# Altium project JCXT.PrjPcb
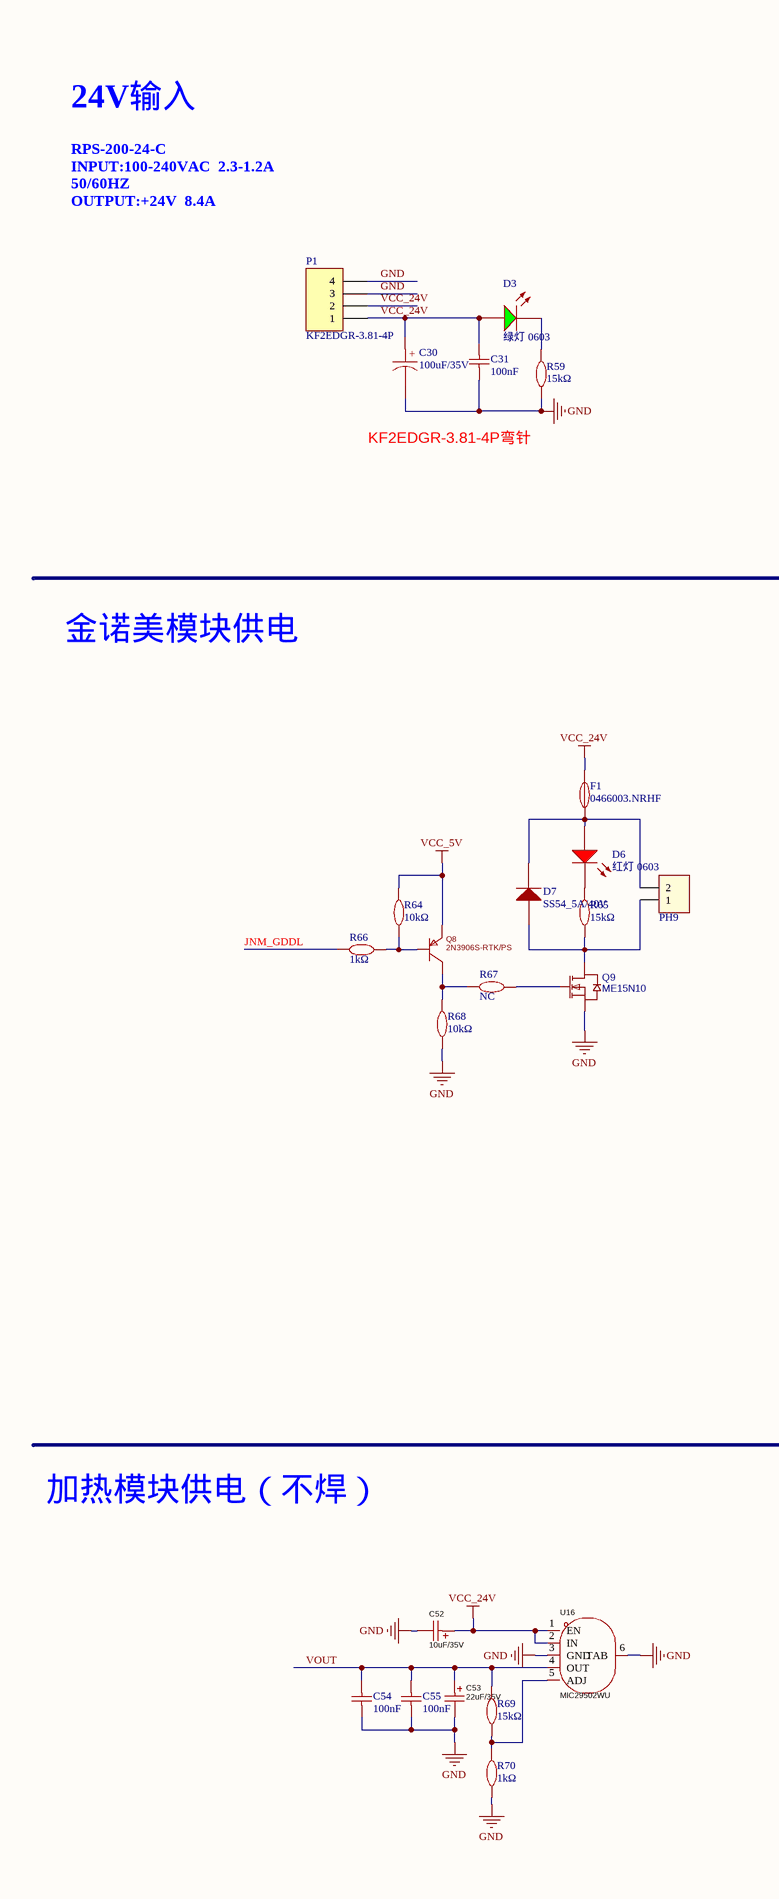
[diagram p0: Power.SchDoc, left]
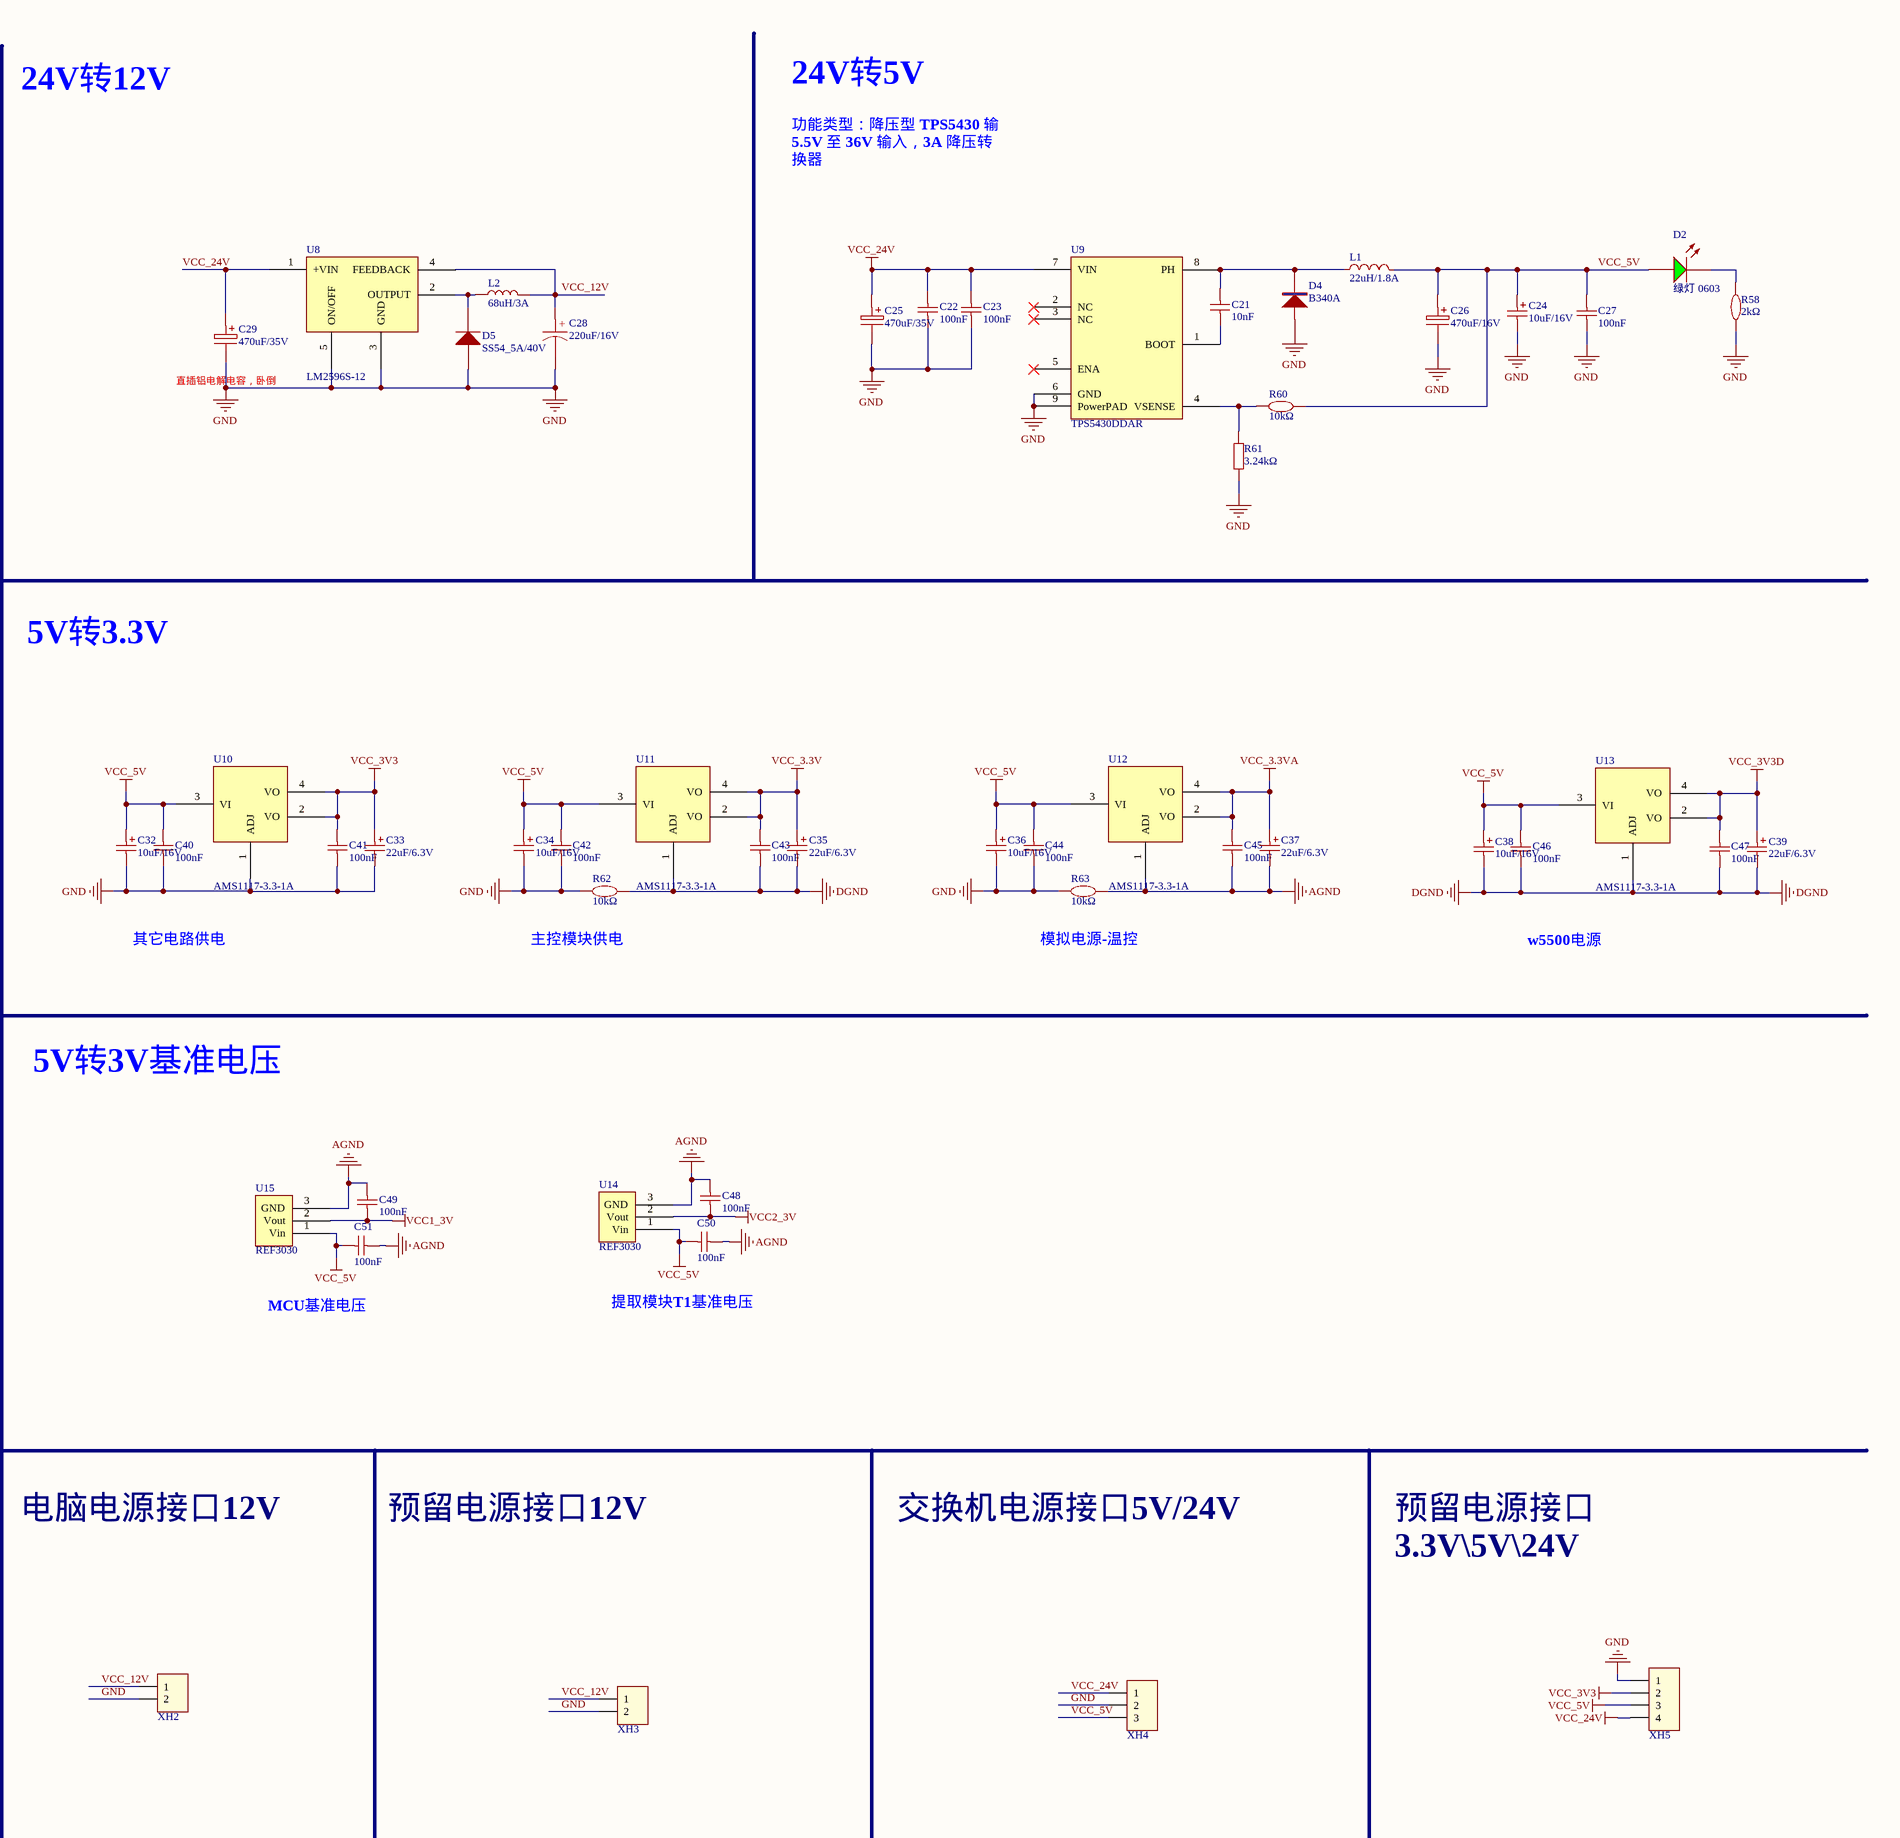
[diagram p1: Power.SchDoc, right]
10 sheets, 309 parts. Net scope: global (net labels, ports and power ports of the same name join across sheets).
Board file: PCB1.PcbDoc
Sheets:
  Power.SchDoc
  EEPROM.SchDoc
  LED.SchDoc
  Motor.SchDoc
  STM32F429.SchDoc
  Temp.SchDoc
  W5500.SchDoc
  CAN.SchDoc
  RS232.SchDoc
  USB.SchDoc

## Sheet Power.SchDoc
size A2

### Parts
C21  10nF  [C0603]
C22  100nF  [C0603]
C23  100nF  [C0603]
C24  10uF/16V  [CASE-A_3216]
C25  470uF/35V  [ELE-S-10.5/D10]
C26  470uF/16V  [ELE-S-10.5/D8.0]
C27  100nF  [C0603]
C28  220uF/16V  [SMD-ECAP-6.3×7.7]
C29  470uF/35V  [ELE-S-10.5/D10]
C30  100uF/35V  [SMD-ECAP-6.3×7.7]
C31  100nF  [C0603]
C32  10uF/16V  [CASE-A_3216]
C33  22uF/6.3V  [CASE-A_3216]
C34  10uF/16V  [CASE-A_3216]
C35  22uF/6.3V  [CASE-A_3216]
C36  10uF/16V  [CASE-A_3216]
C37  22uF/6.3V  [CASE-A_3216]
C38  10uF/16V  [CASE-A_3216]
C39  22uF/6.3V  [CASE-A_3216]
C40  100nF  [C0603]
C41  100nF  [C0603]
C42  100nF  [C0603]
C43  100nF  [C0603]
C44  100nF  [C0603]
C45  100nF  [C0603]
C46  100nF  [C0603]
C47  100nF  [C0603]
C48  100nF  [C0603]
C49  100nF  [C0603]
C50  100nF  [C0603]
C51  100nF  [C0603]
C52  10uF/35V  [CASE-D_7343]
C53  22uF/35V  [CAP-SMD_L7.3-W4.3-RD]
C54  100nF  [C0805]
C55  100nF  [C0805]
D2  绿灯 0603  [LED_0603]
D3  绿灯 0603  [LED_0603]
D4  B340A  [D-SMA]
D5  SS54_5A/40V  [SMA(DO-214AC)_S5]
D6  红灯 0603  [LED_0603]
D7  SS54_5A/40V  [SMA(DO-214AC)_S5]
F1  0466003.NRHF  [F1206]
L1  22uH/1.8A  [L-6X6X4.5]
L2  68uH/3A  [SMD INDUCTOR 68uH 3A]
P1  KF2EDGR-3.81-4P  [KF2EDGK 3.81mm-4P]
PH9  PH2.0-2P  [PH2.0-2P 弯针]  (value not drawn)
Q8  2N3906S-RTK/PS  [SOT-23-3_L2.9-W1.3-P1.90-LS2.4-TR]
Q9  ME15N10  [TO-252-2_L6.6-W6.1-P4.57-LS9.9-TL-CW]
R58  2kΩ  [R0603]
R59  15kΩ  [R0603]
R60  10kΩ  [R0603]
R61  3.24kΩ  [R0603]
R62  10kΩ  [R1206]
R63  10kΩ  [R1206]
R64  10kΩ  [R0603]
R65  15kΩ  [R0603]
R66  1kΩ  [R0603]
R67  NC  [R0603]
R68  10kΩ  [R0603]
R69  15kΩ  [R1206]
R70  1kΩ  [R1206]
U8  LM2596S-12  [TO-263-5]
U9  TPS5430DDAR  [IC-SO8-PAD]
U10  AMS1117-3.3-1A  [LM1117I(SOT223)]
U11  AMS1117-3.3-1A  [LM1117I(SOT223)]
U12  AMS1117-3.3-1A  [LM1117I(SOT223)]
U13  AMS1117-3.3-1A  [LM1117I(SOT223)]
U14  REF3030  [SOT-23(SOT-23-3)]
U15  REF3030  [SOT-23(SOT-23-3)]
U16  MIC29502WU  [TO-263-5_L10.2-W9.9-P1.70-LS14.4-TL]
XH2  PH2.0-2P  [PH2.0-2P 弯针]  (value not drawn)
XH3  PH2.0-2P  [PH2.0-2P 弯针]  (value not drawn)
XH4  PH2.0-3P  [PH2.0-3P 弯针]  (value not drawn)
XH5  PH2.0-4P  [PH2.0-4P 弯针]  (value not drawn)

### Nets
AGND: C37.2 C45.1 C48.2 C49.2 C50.2 C51.2 R63.2 U12.1(ADJ) U14.3(GND) U15.3(GND)
DGND: C35.2 C38.2 C39.2 C43.1 C46.1 C47.1 R62.2 U11.1(ADJ) U13.1(ADJ)
GND: C22.1 C23.1 C24.2 C25.2 C26.2 C27.1 C28.2 C29.2 C30.2 C31.1 C32.2 C33.2 C34.2 C36.2 C40.1 C41.1 C42.1 C44.1 C52.2 C53.2 C54.1 C55.1 D4.1 D5.1(A) P1.3 P1.4 Q9.3(S) R58.2 R59.1 R61.1 R62.1 R63.1 R68.2 R70.2 U8.3(GND) U8.5(ON/OFF) U9.6(GND) U9.9(PowerPAD) U10.1(ADJ) U16.3(GND) U16.6(TAB) XH2.2 XH3.2 XH4.2 XH5.1
VCC1_3V: C49.1 U15.2(Vout)
VCC2_3V: C48.1 U14.2(Vout)
VCC_3.3V: C35.1 C43.2 U11.2(VO) U11.4(VO)
VCC_3.3VA: C37.1 C45.2 U12.2(VO) U12.4(VO)
VCC_3V3: C33.1 C41.2 U10.2(VO) U10.4(VO) XH5.2
VCC_3V3D: C39.1 C47.2 U13.2(VO) U13.4(VO)
VCC_5V: C24.1 C26.1 C27.2 C32.1 C34.1 C36.1 C38.1 C40.2 C42.2 C44.2 C46.2 C50.1 C51.1 D2.A L1.1 Q8.1(E) R60.1 R64.1 U10.3(VI) U11.3(VI) U12.3(VI) U13.3(VI) U14.1(Vin) U15.1(Vin) XH4.3 XH5.3
VCC_12V: C28.1 L2.2 U8.4(FEEDBACK) XH2.1 XH3.1
VCC_24V: C22.2 C23.2 C25.1 C29.1 C30.1 C31.2 C52.1 D3.A F1.2 P1.1 P1.2 U8.1(+VIN) U9.7(VIN) U16.1(EN) U16.2(IN) XH4.1 XH5.4
VOUT: C53.1 C54.2 C55.2 R69.1 U16.4(OUT)
JNM_GDDL: R66.1
NetC21_1: C21.1 U9.1(BOOT)
NetC21_2: C21.2 D4.2 L1.2 U9.8(PH)
NetD2_K: D2.K R58.1
NetD3_K: D3.K R59.2
NetD5_2: D5.2(K) L2.1 U8.2(OUTPUT)
NetD6_A: D6.A D7.2(K) F1.1 PH9.2
NetD6_K: D6.K R65.2
NetD7_1: D7.1(A) PH9.1 Q9.2(D) R65.1
NetQ8_2: Q8.2(B) R64.2 R66.2
NetQ8_3: Q8.3(C) R67.1 R68.1
NetQ9_1: Q9.1(G) R67.2
NetR60_2: R60.2 R61.2 U9.4(VSENSE)
NetR69_2: R69.2 R70.1 U16.5(ADJ)

Not connected (* = marked no-connect by the designer): U9 2(NC)* 3(NC)* 5(ENA)*

### Notes on the sheet
- 24V转5V
- 24V输入
- 24V转12V
- RPS-200-24-C
  INPUT:100-240VAC  2.3-1.2A
  50/60HZ
  OUTPUT:+24V  8.4A
- 功能类型：降压型 TPS5430 输5.5V 至 36V 输入，3A 降压转换器
- (near C29) 直插铝电解电容，卧倒
- KF2EDGR-3.81-4P弯针
- 5V转3.3V
- 金诺美模块供电
- 其它电路供电
- (near R62) 主控模块供电
- (near R63) 模拟电源-温控
- w5500电源
- 5V转3V基准电压
- MCU基准电压
- 提取模块T1基准电压
- 加热模块供电（不焊）
- 电脑电源接口12V
- 预留电源接口12V
- 交换机电源接口5V/24V
- 预留电源接口
  3.3V\5V\24V
- (in symbol 100uF/35V,SMD,6.3x7.7mm) +
- (in symbol 220uF/16V,SMD,D6.3x7.7mm) +

### Library data of the parts
C21 = 10nF/50V,C0603: 贴片电容,X7R; ComponentLink1Description: 供应商链接; ComponentLink1URL: http://www.szlcsc.com/product/details_16531.html
C22 C23 C27 C31 C40-C51 = 100nF/50V,C0603: 贴片电容,X7R; ComponentLink1Description: 供应商链接; ComponentLink1URL: http://www.szlcsc.com/product/details_16531.html
C24 C32 C34 C36 C38 = 10uF/16V,CASE-A_3216 : 钽电容;±10%;16V; ComponentLink1Description: 供应商链接; ComponentLink1URL: http://www.szlcsc.com/product/details_7643.html
C25 C29 = 470uF/35V,D10*10.5mm: 贴片型铝电解电容
C26 = 470uF/16V,D8*10.5mm: 贴片型铝电解电容
C28 = 220uF/16V,SMD,D6.3x7.7mm: 贴片型铝电解电容
C30 = 100uF/35V,SMD,6.3x7.7mm: 贴片型铝电解电容
C33 C35 C37 C39 = 22uF/6.3V,CASE-A_3216: 钽电容;±10%;6.3V; ComponentLink1Description: 供应商链接; ComponentLink1URL: http://www.szlcsc.com/product/details_7643.html
C52 = 10uF/35V,CASE-D-7343: TAJD106K035RNJ;钽电容;容值 10uF;精度 ±10%; 额定电压 35V;等效串联电阻(ESR) 1Ω@100kHz
C53 = 22uF/35V,CASE-D-7343: TAJD226K035RNJ;钽电容;容值 22uF; 精度 ±10%额定电压 35V;等效串联电阻(ESR) 900mΩ@100kHz
C54 C55 = 100nF/50V,C0805: 贴片电容,X7R; ComponentLink1Description: 供应商链接; ComponentLink1URL: http://www.szlcsc.com/product/details_16531.html
D2 D3 = 绿灯 0603: 发光二极管; ComponentLink1Description: 供应商链接; ComponentLink1URL: http://www.szlcsc.com/product/details_73152.html
D4 = B340A: 肖特基二极管；正向压降(Vf) 550mV@3A； 直流反向耐压(Vr) 40V； 整流电流 3A； 反向电流(Ir) 500uA@40V
D5 D7 = SS54_5A/40V: 肖特基二极管; ComponentLink1Description: Manufacturer Link; ComponentLink1URL: http://www.fairchildsemi.com/; ComponentLink2Description: Datasheet; ComponentLink2URL: http://www.fairchildsemi.com/ds/1N%2F1N4001.pdf
D6 = 红灯 0603: 发光二极管; ComponentLink1Description: 供应商链接; ComponentLink1URL: http://www.szlcsc.com/product/details_2659.html
F1 = 0466003.NRHF: 一次性贴片式保险丝；额定电流 3A；额定电压 (AC) 32V
L1 = 22uH/1.8A,L-6X6X4.5: SWPA6045S220MT;功率电感;SMD,6x6mm;电感值 22uH;精度 ±20%;额定电流 1.8A;饱和电流(Isat) 2.2A;直流电阻(DCR) 89mΩ
L2 = 68uH/3A,SMD,11.5x10mm: YSPI1050-680M;功率电感;电感值 68uH;精度 ±20%;额定电流 3A;直流电阻(DCR) 240mΩ
P1 = KF2EDGR-3.81-4P: C441184
Q8 = 2N3906S-RTK/PS: Manufacturer: KEC; Symbol: 2N3906S-RTK/PS_C5300004; Add into BOM: yes; Current - Collector(Ic): 200mA; Collector - Emitter Voltage VCEO: 40V; Pd - Power Dissipation: 350mW; DC Current Gain: 300@10mA,1V; Transition frequency(fT): 250MHz; Current - Collector Cutoff: 50nA; Vce Saturation(VCE(sat)): 400mV@50mA,5mA; Emitter-Base Voltage(Vebo): 5V; Device: 2N3906S-RTK/PS; LCSC Part Name: 2N3906S-RTK/PS; Supplier Part: C5300004; Manufacturer Part: 2N3906S-RTK/PS; Supplier Footprint: SOT-23; JLCPCB Part Class: Extended Part; Datasheet: https://item.szlcsc.com/datasheet/2N3906S-RTK%252FPS/6051230.html; Supplier: LCSC; Convert to PCB: yes
Q9 = ME15N10: 场效应管(MOSFET);N沟道
R58 = 2kΩ,R0603: 贴片电阻
R59 R65 = 15kΩ,R0603: 贴片电阻
R60 R64 R68 = 10kΩ,R0603: 电阻类型:厚膜电阻;阻值:10kΩ;精度:±1%;功率:100mW;最大工作电压:75V;温度系数:±100ppm/℃;
R61 = 3.24kΩ,R0603: 贴片电阻3.24KΩ;1%; ComponentLink1Description: 供应商链接; ComponentLink1URL: http://www.szlcsc.com/product/details_21904.html
R62 R63 = 0603WAF1002T5E: 贴片电阻
R66 = 1kΩ,R0603: 电阻类型:厚膜电阻;阻值:1kΩ;精度:±1%;功率:125mW;最大工作电压:150V;温度系数:±100ppm/℃;
R67 = NC,R0603
R69 = 15kΩ,R1206: 贴片电阻
R70 = 1kΩ,R1206: 贴片电阻
U9 = TPS5430DDAR: DC-DC电源芯片；降压型；可调； 工作电压 5.5V~36V；输出电压 1.221V~32.04V；输出电流 3A / 开关频率 500kHz
U10-U13 = AMS1117-3.3-1A: 800mA Low Dropout Regulator
U14 U15 = REF3030: REF3030AIDBZR/REF3030AIDBZT
U16 = MIC29502WU: 线性稳压器(LDO)

## Sheet EEPROM.SchDoc
size A4
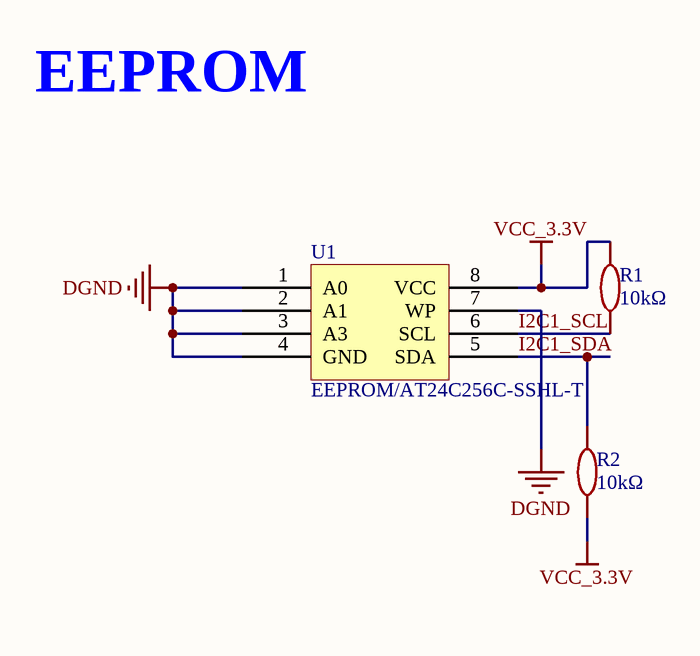
[diagram p2: EEPROM.SchDoc]

### Parts
R1  10kΩ  [R0402]
R2  10kΩ  [R0402]
U1  EEPROM/AT24C256C-SSHL-T  [SOIC-8_150mil]

### Nets
DGND: U1.1(A0) U1.2(A1) U1.3(A3) U1.4(GND) U1.7(WP)
VCC_3.3V: R1.2 R2.1 U1.8(VCC)
I2C1_SCL: R1.1 U1.6(SCL)
I2C1_SDA: R2.2 U1.5(SDA)

### Notes on the sheet
- EEPROM

### Library data of the parts
R1 R2 = 10kΩ,R0402: 电阻类型:厚膜电阻;阻值:10kΩ;精度:±1%;功率:100mW;最大工作电压:75V;温度系数:±100ppm/℃;
U1 = EEPROM/AT24C256C-SSHL-T_[C6482]: EEPROM; ComponentLink1Description: 供应商链接; ComponentLink1URL: http://www.szlcsc.com/product/details_6947.html

## Sheet LED.SchDoc
size A4
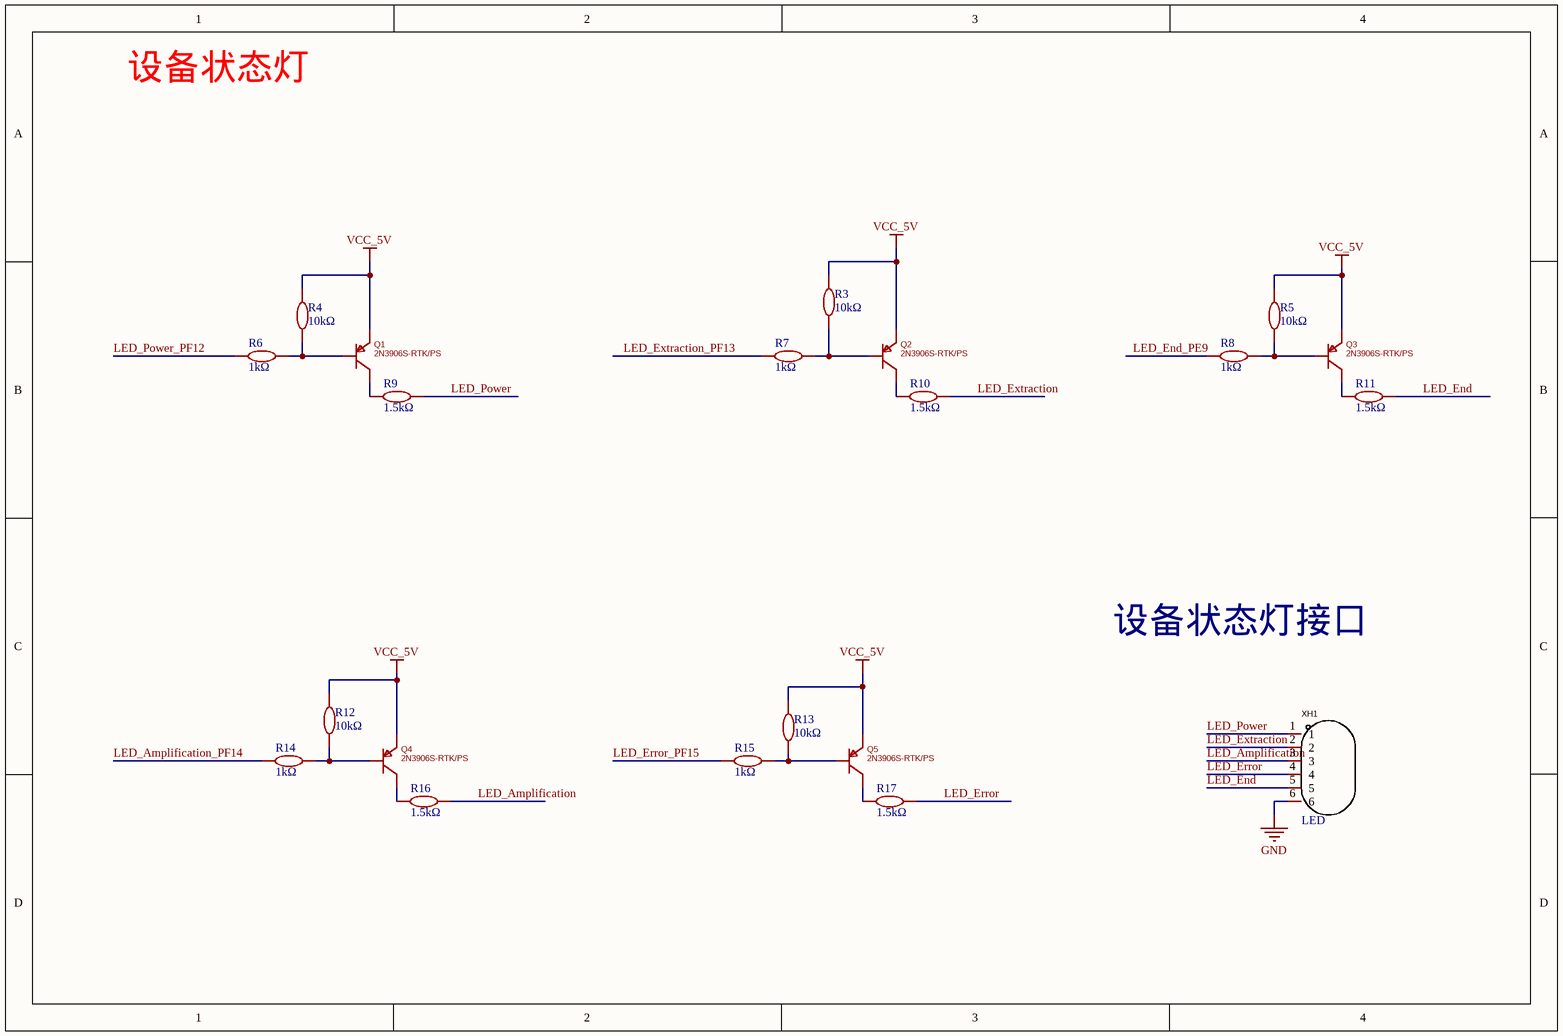
[diagram p3: LED.SchDoc]

### Parts
Q1  2N3906S-RTK/PS  [SOT-23-3_L2.9-W1.3-P1.90-LS2.4-TR]
Q2  2N3906S-RTK/PS  [SOT-23-3_L2.9-W1.3-P1.90-LS2.4-TR]
Q3  2N3906S-RTK/PS  [SOT-23-3_L2.9-W1.3-P1.90-LS2.4-TR]
Q4  2N3906S-RTK/PS  [SOT-23-3_L2.9-W1.3-P1.90-LS2.4-TR]
Q5  2N3906S-RTK/PS  [SOT-23-3_L2.9-W1.3-P1.90-LS2.4-TR]
R3  10kΩ  [R0603]
R4  10kΩ  [R0603]
R5  10kΩ  [R0603]
R6  1kΩ  [R0603]
R7  1kΩ  [R0603]
R8  1kΩ  [R0603]
R9  1.5kΩ  [R0603]
R10  1.5kΩ  [R0603]
R11  1.5kΩ  [R0603]
R12  10kΩ  [R0603]
R13  10kΩ  [R0603]
R14  1kΩ  [R0603]
R15  1kΩ  [R0603]
R16  1.5kΩ  [R0603]
R17  1.5kΩ  [R0603]
XH1  LED  [CONN-TH_6P-P2.00_S6B-PH-K-S-LF-SN]

### Nets
GND: XH1.6
VCC_5V: Q1.1(E) Q2.1(E) Q3.1(E) Q4.1(E) Q5.1(E) R3.2 R4.2 R5.2 R12.2 R13.2
LED_Amplification: R16.1 XH1.3
LED_Amplification_PF14: R14.2
LED_End: R11.1 XH1.5
LED_End_PE9: R8.2
LED_Error: R17.1 XH1.4
LED_Error_PF15: R15.2
LED_Extraction: R10.1 XH1.2
LED_Extraction_PF13: R7.2
LED_Power: R9.2 XH1.1
LED_Power_PF12: R6.2
NetQ1_2: Q1.2(B) R4.1 R6.1
NetQ1_3: Q1.3(C) R9.1
NetQ2_2: Q2.2(B) R3.1 R7.1
NetQ2_3: Q2.3(C) R10.2
NetQ3_2: Q3.2(B) R5.1 R8.1
NetQ3_3: Q3.3(C) R11.2
NetQ4_2: Q4.2(B) R12.1 R14.1
NetQ4_3: Q4.3(C) R16.2
NetQ5_2: Q5.2(B) R13.1 R15.1
NetQ5_3: Q5.3(C) R17.2

### Notes on the sheet
- 设备状态灯
- 设备状态灯接口

### Library data of the parts
Q1-Q5 = 2N3906S-RTK/PS: as Q8 on sheet Power; Device: 2N3906S-RTK/PS; LCSC Part Name: 2N3906S-RTK/PS; Supplier Part: C5300004; Manufacturer Part: 2N3906S-RTK/PS; Supplier Footprint: SOT-23; JLCPCB Part Class: Extended Part; Datasheet: https://item.szlcsc.com/datasheet/2N3906S-RTK%252FPS/6051230.html; Supplier: LCSC; Convert to PCB: yes
R3-R5 R12 R13 = 10kΩ,R0603: as R60 on sheet Power
R6-R8 R14 R15 = 1kΩ,R0603: as R66 on sheet Power
R9-R11 R16 R17 = 1.5kΩ,R0603: 电阻类型:厚膜电阻;阻值:1.5kΩ;精度:±1%;功率:100mW;最大工作电压:75V;温度系数:±100ppm/℃;
XH1 = S6B-PH-K-S(LF)(SN)

## Sheet Motor.SchDoc
size A2
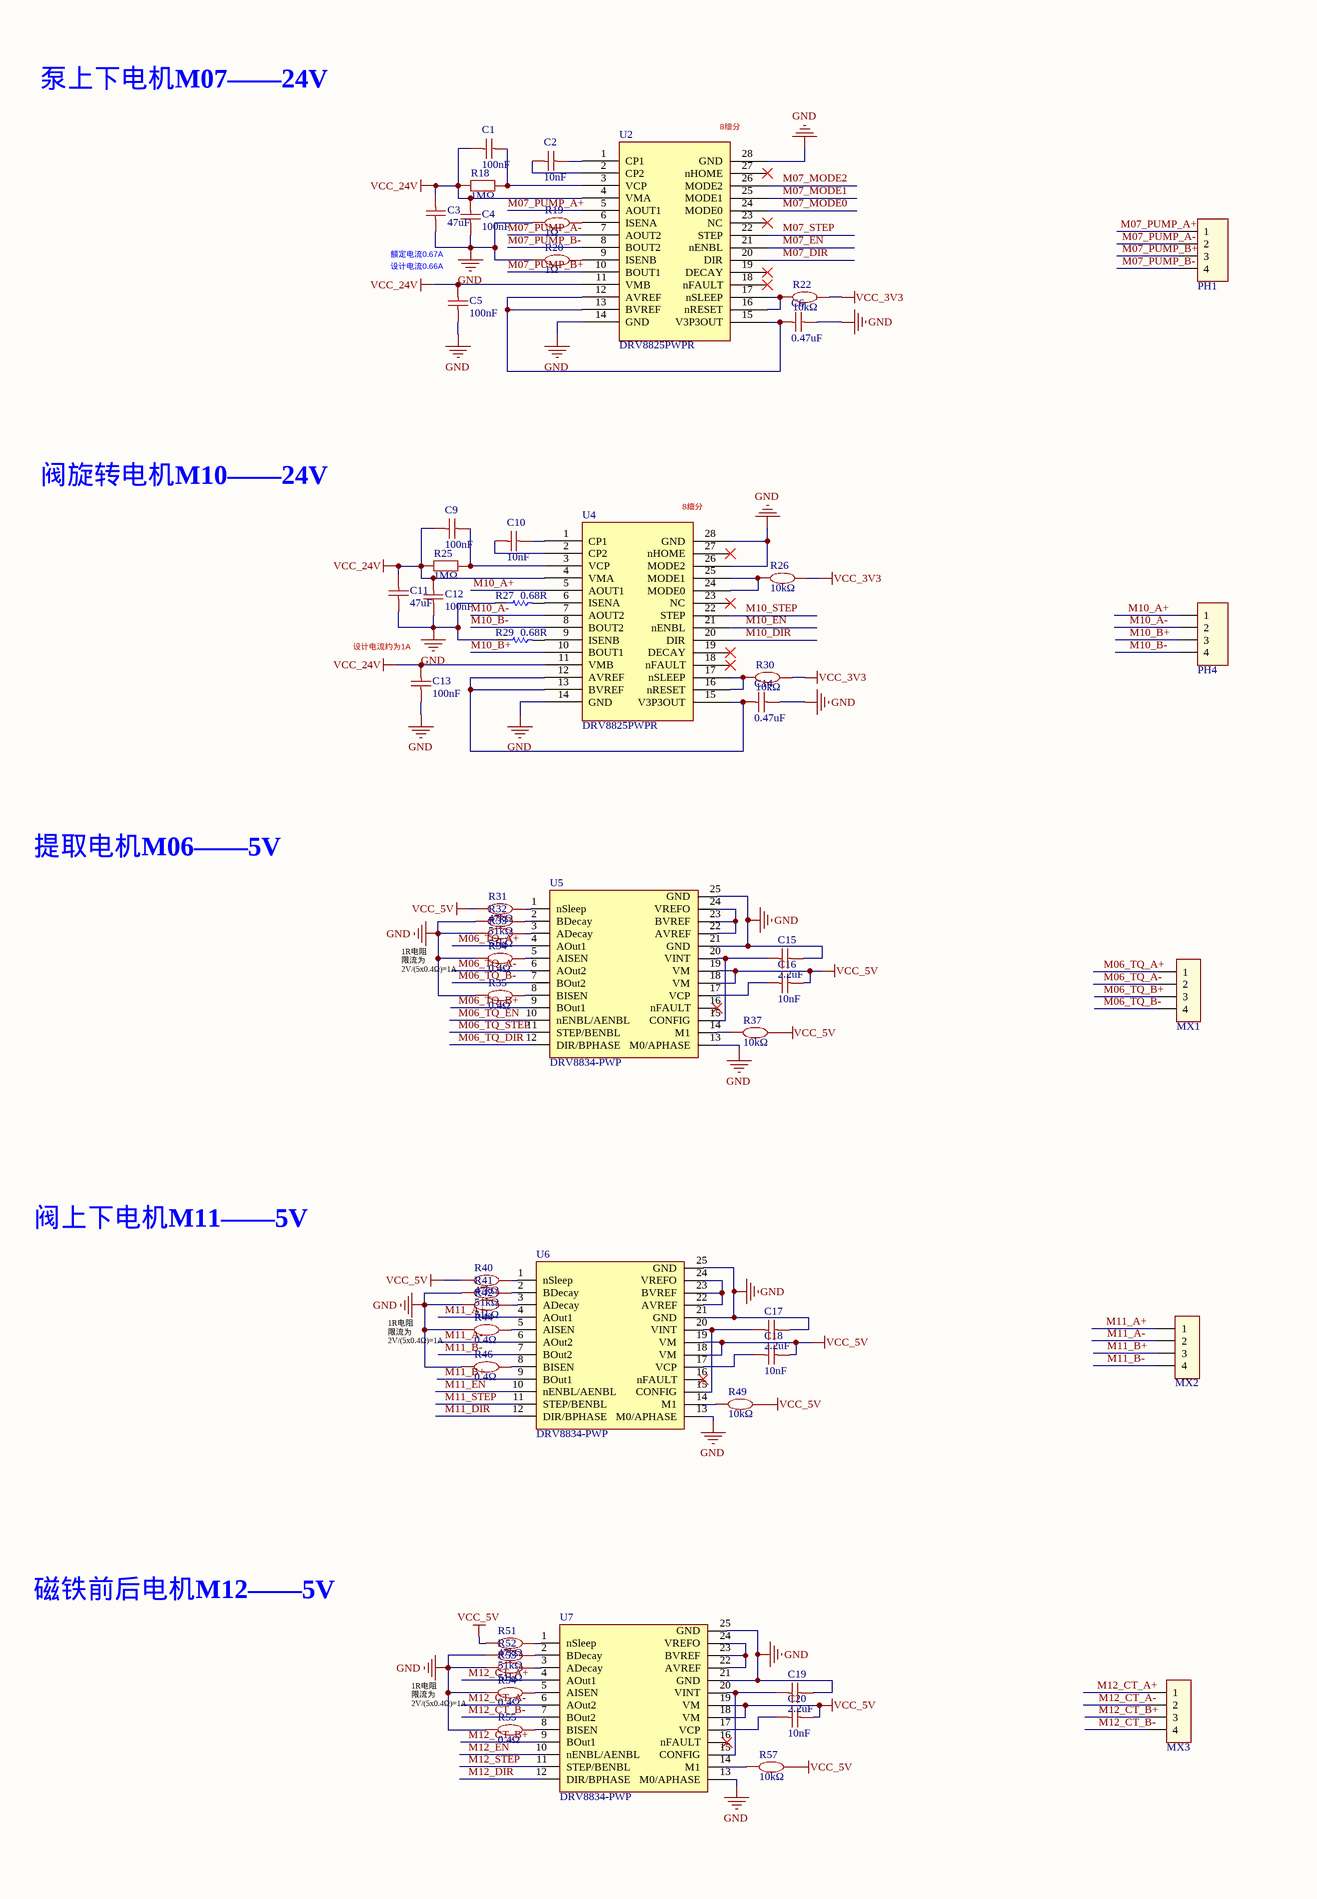
[diagram p4: Motor.SchDoc, left]
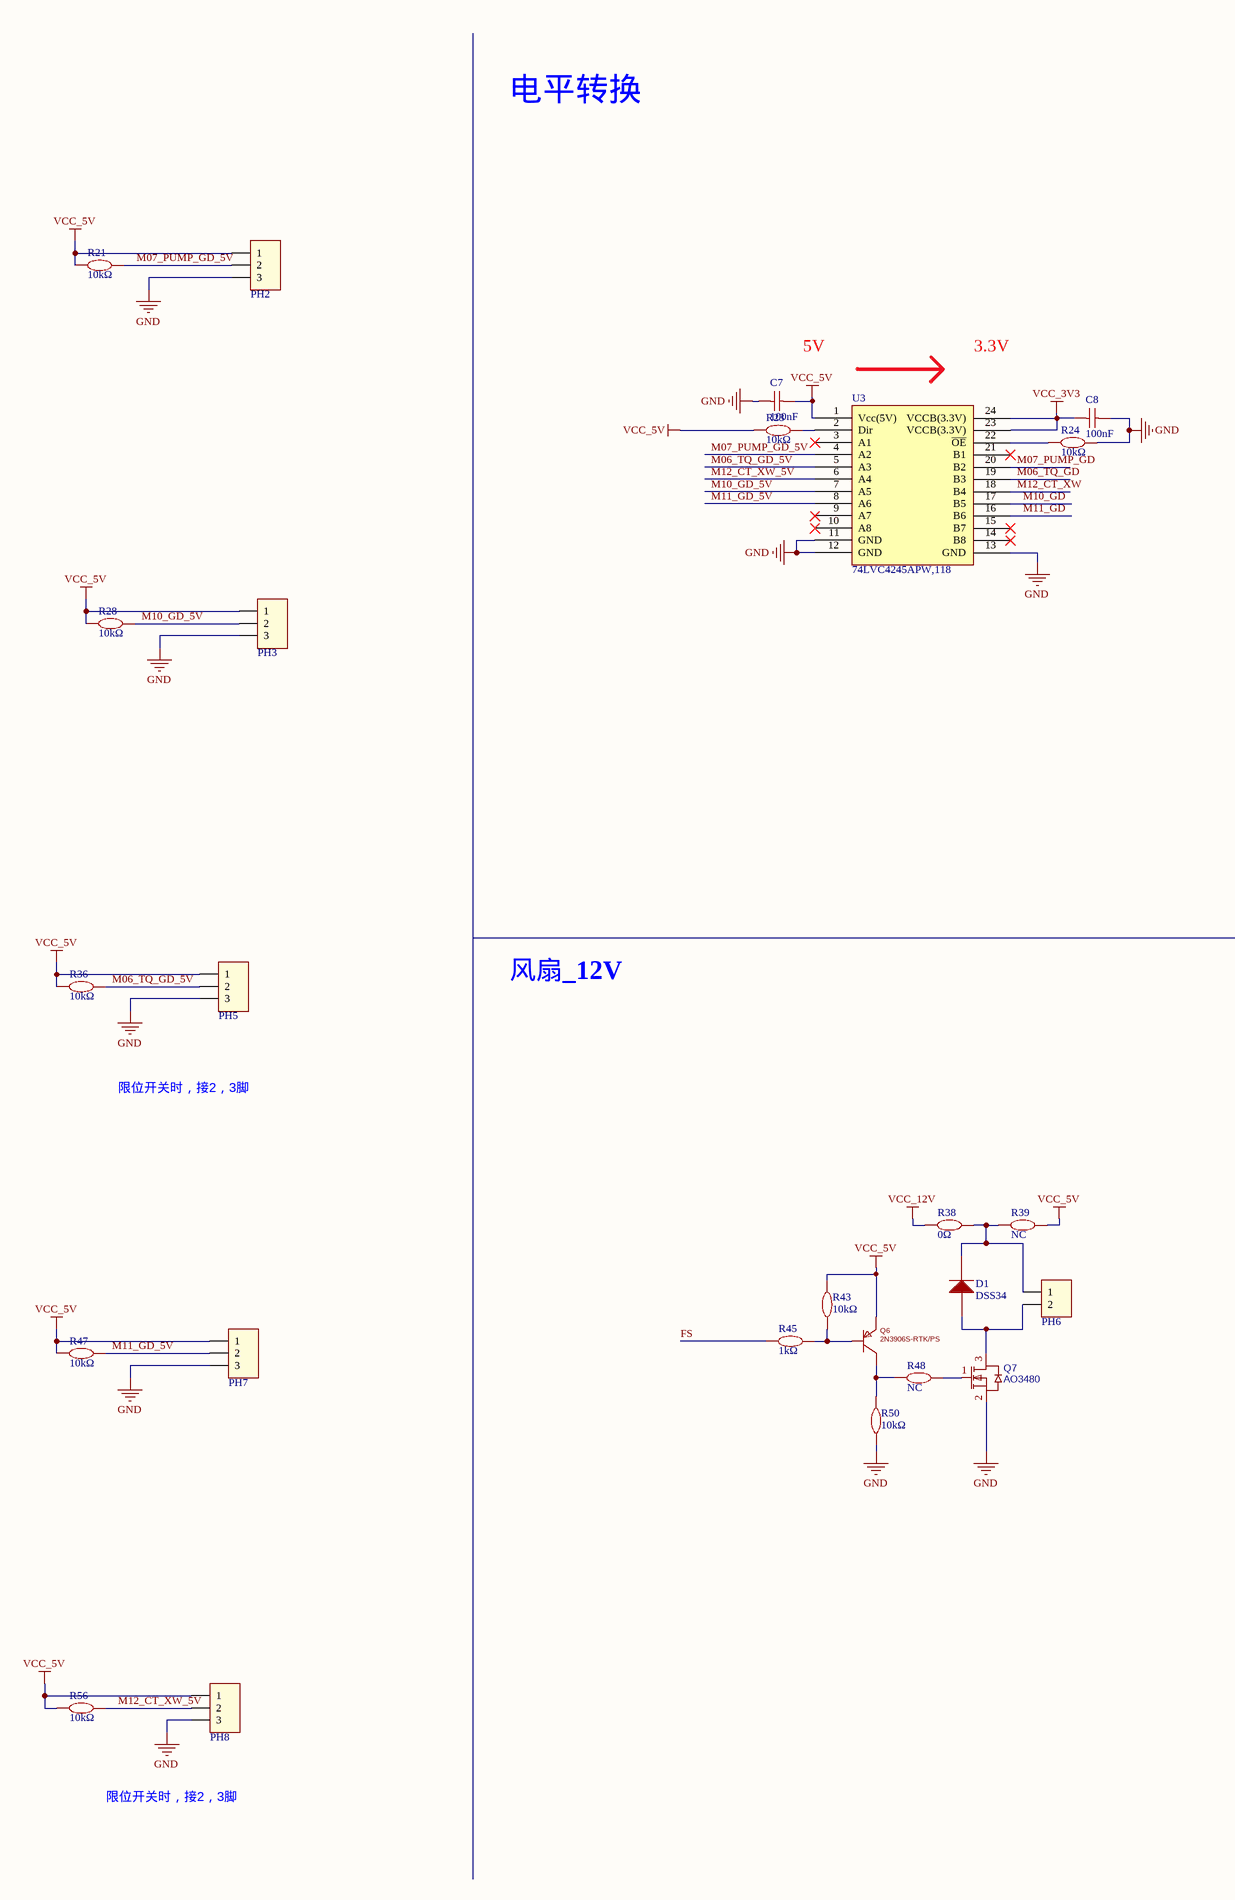
[diagram p5: Motor.SchDoc, right]

### Parts
C1  100nF  [C0603]
C2  10nF  [C0603]
C3  47uF  [C1210]
C4  100nF  [C0603]
C5  100nF  [C0603]
C6  0.47uF  [C0603]
C7  100nF  [C0603]
C8  100nF  [C0603]
C9  100nF  [C0603]
C10  10nF  [C0603]
C11  47uF  [C1210]
C12  100nF  [C0603]
C13  100nF  [C0603]
C14  0.47uF  [C0603]
C15  2.2uF  [C0603]
C16  10nF  [C0603]
C17  2.2uF  [C0603]
C18  10nF  [C0603]
C19  2.2uF  [C0603]
C20  10nF  [C0603]
D1  DSS34  [SOD-123]
MX1  MX1.25-4P  [CONN-TH_4P-P1.25_HCTL_HC-1.25-4AW]  (value not drawn)
MX2  MX1.25-4P  [CONN-TH_4P-P1.25_HCTL_HC-1.25-4AW]  (value not drawn)
MX3  MX1.25-4P  [CONN-TH_4P-P1.25_HCTL_HC-1.25-4AW]  (value not drawn)
PH1  PH2.0-4P  [PH2.0-4P 弯针]  (value not drawn)
PH2  PH2.0-3P  [PH2.0-3P 弯针]  (value not drawn)
PH3  PH2.0-3P  [PH2.0-3P 弯针]  (value not drawn)
PH4  PH2.0-4P  [PH2.0-4P 弯针]  (value not drawn)
PH5  PH2.0-3P  [PH2.0-3P 弯针]  (value not drawn)
PH6  PH2.0-2P  [PH2.0-2P 弯针]  (value not drawn)
PH7  PH2.0-3P  [PH2.0-3P 弯针]  (value not drawn)
PH8  PH2.0-3P  [PH2.0-3P 弯针]  (value not drawn)
Q6  2N3906S-RTK/PS  [SOT-23-3_L2.9-W1.3-P1.90-LS2.4-TR]
Q7  AO3480  [SOT-23(SOT-23-3)]
R18  1MΩ  [R0603]
R19  1Ω  [R0603]
R20  1Ω  [R0603]
R21  10kΩ  [R0603]
R22  10kΩ  [R0603]
R23  10kΩ  [R0603]
R24  10kΩ  [R0603]
R25  1MΩ  [R0603]
R26  10kΩ  [R0603]
R27  0.68R  [R0603]
R28  10kΩ  [R0603]
R29  0.68R  [R0603]
R30  10kΩ  [R0603]
R31  47kΩ  [R0603]
R32  51kΩ  [R0603]
R33  51kΩ  [R0603]
R34  0.4Ω  [R0603]
R35  0.4Ω  [R0603]
R36  10kΩ  [R0603]
R37  10kΩ  [R0603]
R38  0Ω  [R0603]
R39  NC  [R0603]
R40  47kΩ  [R0603]
R41  51kΩ  [R0603]
R42  51kΩ  [R0603]
R43  10kΩ  [R0603]
R44  0.4Ω  [R0603]
R45  1kΩ  [R0603]
R46  0.4Ω  [R0603]
R47  10kΩ  [R0603]
R48  NC  [R0603]
R49  10kΩ  [R0603]
R50  10kΩ  [R0603]
R51  47kΩ  [R0603]
R52  51kΩ  [R0603]
R53  51kΩ  [R0603]
R54  0.4Ω  [R0603]
R55  0.4Ω  [R0603]
R56  10kΩ  [R0603]
R57  10kΩ  [R0603]
U2  DRV8825PWPR  [HTSSOP-28]
U3  74LVC4245APW,118  [TSSOP-24]
U4  DRV8825PWPR  [HTSSOP-28]
U5  DRV8834-PWP  [HTSSOP-24]
U6  DRV8834-PWP  [HTSSOP-24]
U7  DRV8834-PWP  [HTSSOP-24]

### Nets
GND: C3.1 C4.1 C5.1 C6.2 C7.1 C8.2 C11.1 C12.1 C13.1 C14.2 C15.1 C17.1 C19.1 PH2.3 PH3.3 PH5.3 PH7.3 PH8.3 Q7.2(S) R19.1 R20.1 R24.1 R27.1 R29.1 R32.2 R33.2 R34.2 R35.2 R41.2 R42.2 R44.2 R46.2 R50.1 R52.2 R53.2 R54.2 R55.2 U2.14(GND) U2.28(GND) U3.11(GND) U3.12(GND) U3.13(GND) U4.14(GND) U4.26(MODE2) U4.28(GND) U5.13(M0/APHASE) U5.21(GND) U5.25(GND) U6.13(M0/APHASE) U6.21(GND) U6.25(GND) U7.13(M0/APHASE) U7.21(GND) U7.25(GND)
VCC_3V3: C8.1 R22.2 R26.2 R30.2 U3.23(VCCB(3.3V)) U3.24(VCCB(3.3V))
VCC_5V: C7.2 C16.1 C18.1 C20.1 PH2.1 PH3.1 PH5.1 PH7.1 PH8.1 Q6.1(E) R21.2 R23.2 R28.2 R31.2 R36.2 R37.1 R39.2 R40.2 R43.2 R47.2 R49.1 R51.2 R56.1 R57.1 U3.1(Vcc(5V)) U5.18(VM) U5.19(VM) U6.18(VM) U6.19(VM) U7.18(VM) U7.19(VM)
VCC_12V: R38.1
VCC_24V: C1.1 C3.2 C4.2 C5.2 C9.1 C11.2 C12.2 C13.2 R18.1 R25.1 U2.4(VMA) U2.11(VMB) U4.4(VMA) U4.11(VMB)
FS: R45.2
M06_TQ_A+: MX1.1 U5.4(AOut1)
M06_TQ_A-: MX1.2 U5.6(AOut2)
M06_TQ_B+: MX1.3 U5.9(BOut1)
M06_TQ_B-: MX1.4 U5.7(BOut2)
M06_TQ_DIR: U5.12(DIR/BPHASE)
M06_TQ_EN: U5.10(nENBL/AENBL)
M06_TQ_GD: U3.19(B3)
M06_TQ_GD_5V: PH5.2 R36.1 U3.5(A3)
M06_TQ_STEP: U5.11(STEP/BENBL)
M07_DIR: U2.20(DIR)
M07_EN: U2.21(nENBL)
M07_MODE0: U2.24(MODE0)
M07_MODE1: U2.25(MODE1)
M07_MODE2: U2.26(MODE2)
M07_PUMP_A+: PH1.1 U2.5(AOUT1)
M07_PUMP_A-: PH1.2 U2.7(AOUT2)
M07_PUMP_B+: PH1.3 U2.10(BOUT1)
M07_PUMP_B-: PH1.4 U2.8(BOUT2)
M07_PUMP_GD: U3.20(B2)
M07_PUMP_GD_5V: PH2.2 R21.1 U3.4(A2)
M07_STEP: U2.22(STEP)
M10_A+: PH4.1 U4.5(AOUT1)
M10_A-: PH4.2 U4.7(AOUT2)
M10_B+: PH4.3 U4.10(BOUT1)
M10_B-: PH4.4 U4.8(BOUT2)
M10_DIR: U4.20(DIR)
M10_EN: U4.21(nENBL)
M10_GD: U3.17(B5)
M10_GD_5V: PH3.2 R28.1 U3.7(A5)
M10_STEP: U4.22(STEP)
M11_A+: MX2.1 U6.4(AOut1)
M11_A-: MX2.2 U6.6(AOut2)
M11_B+: MX2.3 U6.9(BOut1)
M11_B-: MX2.4 U6.7(BOut2)
M11_DIR: U6.12(DIR/BPHASE)
M11_EN: U6.10(nENBL/AENBL)
M11_GD: U3.16(B6)
M11_GD_5V: PH7.2 R47.1 U3.8(A6)
M11_STEP: U6.11(STEP/BENBL)
M12_CT_A+: MX3.1 U7.4(AOut1)
M12_CT_A-: MX3.2 U7.6(AOut2)
M12_CT_B+: MX3.3 U7.9(BOut1)
M12_CT_B-: MX3.4 U7.7(BOut2)
M12_CT_XW: U3.18(B4)
M12_CT_XW_5V: PH8.2 R56.2 U3.6(A4)
M12_DIR: U7.12(DIR/BPHASE)
M12_EN: U7.10(nENBL/AENBL)
M12_STEP: U7.11(STEP/BENBL)
NetC1_2: C1.2 R18.2 U2.3(VCP)
NetC2_1: C2.1 U2.2(CP2)
NetC2_2: C2.2 U2.1(CP1)
NetC6_1: C6.1 U2.12(AVREF) U2.13(BVREF) U2.15(V3P3OUT)
NetC9_2: C9.2 R25.2 U4.3(VCP)
NetC10_1: C10.1 U4.2(CP2)
NetC10_2: C10.2 U4.1(CP1)
NetC14_1: C14.1 U4.12(AVREF) U4.13(BVREF) U4.15(V3P3OUT)
NetC15_2: C15.2 U5.15(CONFIG) U5.20(VINT)
NetC16_2: C16.2 U5.17(VCP)
NetC17_2: C17.2 U6.15(CONFIG) U6.20(VINT)
NetC18_2: C18.2 U6.17(VCP)
NetC19_2: C19.2 U7.15(CONFIG) U7.20(VINT)
NetC20_2: C20.2 U7.17(VCP)
NetD1_1: D1.1(A) PH6.2 Q7.3(D)
NetD1_2: D1.2(K) PH6.1 R38.2 R39.1
NetQ6_2: Q6.2(B) R43.1 R45.1
NetQ6_3: Q6.3(C) R48.1 R50.2
NetQ7_1: Q7.1(G) R48.2
NetR19_2: R19.2 U2.6(ISENA)
NetR20_2: R20.2 U2.9(ISENB)
NetR22_1: R22.1 U2.16(nRESET) U2.17(nSLEEP)
NetR23_1: R23.1 U3.2(Dir)
NetR24_2: R24.2 U3.22(~{OE})
NetR26_1: R26.1 U4.24(MODE0) U4.25(MODE1)
NetR27_2: R27.2 U4.6(ISENA)
NetR29_2: R29.2 U4.9(ISENB)
NetR30_1: R30.1 U4.16(nRESET) U4.17(nSLEEP)
NetR31_1: R31.1 U5.1(nSleep)
NetR32_1: R32.1 U5.2(BDecay)
NetR33_1: R33.1 U5.3(ADecay)
NetR34_1: R34.1 U5.5(AISEN)
NetR35_1: R35.1 U5.8(BISEN)
NetR37_2: R37.2 U5.14(M1)
NetR40_1: R40.1 U6.1(nSleep)
NetR41_1: R41.1 U6.2(BDecay)
NetR42_1: R42.1 U6.3(ADecay)
NetR44_1: R44.1 U6.5(AISEN)
NetR46_1: R46.1 U6.8(BISEN)
NetR49_2: R49.2 U6.14(M1)
NetR51_1: R51.1 U7.1(nSleep)
NetR52_1: R52.1 U7.2(BDecay)
NetR53_1: R53.1 U7.3(ADecay)
NetR54_1: R54.1 U7.5(AISEN)
NetR55_1: R55.1 U7.8(BISEN)
NetR57_2: R57.2 U7.14(M1)
NetU5_22: U5.22(AVREF) U5.23(BVREF) U5.24(VREFO)
NetU6_22: U6.22(AVREF) U6.23(BVREF) U6.24(VREFO)
NetU7_22: U7.22(AVREF) U7.23(BVREF) U7.24(VREFO)

Not connected (* = marked no-connect by the designer): U2 18(nFAULT)* 19(DECAY)* 23(NC)* 27(nHOME)*; U3 3(A1)* 9(A7)* 10(A8)* 14(B8)* 15(B7)* 21(B1)*; U4 18(nFAULT)* 19(DECAY)* 23(NC)* 27(nHOME)*; U5 16(nFAULT)*; U6 16(nFAULT)*; U7 16(nFAULT)*

### Notes on the sheet
- 泵上下电机M07——24V
- (near U2) 8细分
- 电平转换
- 额定电流0.67A
- 设计电流0.66A
- 5V
- 3.3V
- 阀旋转电机M10——24V
- (near U4) 8细分
- 设计电流约为1A
- 提取电机M06——5V
- 1R电阻限流为2V/(5x0.4Ω)=1A
- 风扇_12V
- 限位开关时，接2，3脚
- 阀上下电机M11——5V
- 磁铁前后电机M12——5V
- Title
- Size:
- Date:
- File:
- A2
- Number:
- Time:
- Revision:
- Sheet
- of

### Library data of the parts
C1 C4 C5 C7-C9 C12 C13 = 100nF/50V,C0603: 贴片电容,X7R; ComponentLink1Description: 供应商链接; ComponentLink1URL: http://www.szlcsc.com/product/details_16531.html
C2 C10 C16 C18 C20 = 10nF/50V,C0603: 贴片电容,X7R; ComponentLink1Description: 供应商链接; ComponentLink1URL: http://www.szlcsc.com/product/details_16531.html
C3 C11 = 47uF/25V,C1210: 贴片电容,X7R; ComponentLink1Description: 供应商链接; ComponentLink1URL: http://www.szlcsc.com/product/details_2206.html
C6 C14 = 0.47uF/50V,C0603: 贴片电容,X7R; ComponentLink1Description: 供应商链接; ComponentLink1URL: http://www.szlcsc.com/product/details_16531.html
C15 C17 C19 = 2.2uF/50V,C0603: 贴片电容,X7R; ComponentLink1Description: 供应商链接; ComponentLink1URL: http://www.szlcsc.com/product/details_16531.html
D1 = DSS34,SOD-123: 肖特基二极管; ComponentLink1Description: 供应商链接; ComponentLink1URL: http://www.szlcsc.com/product/details_9093.html
Q6 = 2N3906S-RTK/PS: as Q8 on sheet Power; Device: 2N3906S-RTK/PS; LCSC Part Name: 2N3906S-RTK/PS; Supplier Part: C5300004; Manufacturer Part: 2N3906S-RTK/PS; Supplier Footprint: SOT-23; JLCPCB Part Class: Extended Part; Datasheet: https://item.szlcsc.com/datasheet/2N3906S-RTK%252FPS/6051230.html; Supplier: LCSC; Convert to PCB: yes
Q7 = AO3480: 场效应管(MOSFET)；漏源电压(Vdss) 30V；连续漏极电流(Id) 5.8A；导通电阻(RDS(on)) 41mΩ@10V,5.8A；耗散功率(Pd) 1.4W；阈值电压(Vgs(th)) 1.4V；栅极电荷量(Qg) 9.5nC@15V；输入电容(Ciss@Vds) 820pF@15V；反向传输电容(Crss) 77pF
R18 R25 = 1MΩ,R0603: 贴片电阻; ComponentLink1Description: 供应商链接; ComponentLink1URL: http://www.szlcsc.com/product/details_23662.html
R19 R20 = 1Ω,R0603: 贴片电阻
R21-R24 R26 R28 R30 R36 R37 R43 R47 R49 R50 R56 R57 = 10kΩ,R0603: as R60 on sheet Power
R27 R29 = Res: Resistor; Published: 8-Jun-2000; LatestRevisionDate: 17-Jul-2002; LatestRevisionNote: Re-released for DXP Platform.; PackageReference: AXIAL-0.3; Publisher: Altium Limited
R31 R40 R51 = 47kΩ,R0603: 贴片电阻
R32 R33 R41 R42 R52 R53 = 51kΩ,R0603: 电阻类型:厚膜电阻;阻值:51kΩ;精度:±1%;功率:100mW;最大工作电压:75V;温度系数:±100ppm/℃;
R34 R35 R44 R46 R54 R55 = 0.4Ω,R0603: 贴片电阻
R38 = 0Ω,R0603: 贴片电阻
R39 R48 = NC,R0603
R45 = 1kΩ,R0603: as R66 on sheet Power
U3 = 74LVC4245APW: 转换器/电平移位器；通道类型 双向；工作电压(VCCA) 1.5V~5.5V；工作电压(VCCB) 1.5V~3.6V； 通道数 1； / 每个电路通道数 8；输出类型 三态

## Sheet STM32F429.SchDoc
size A3
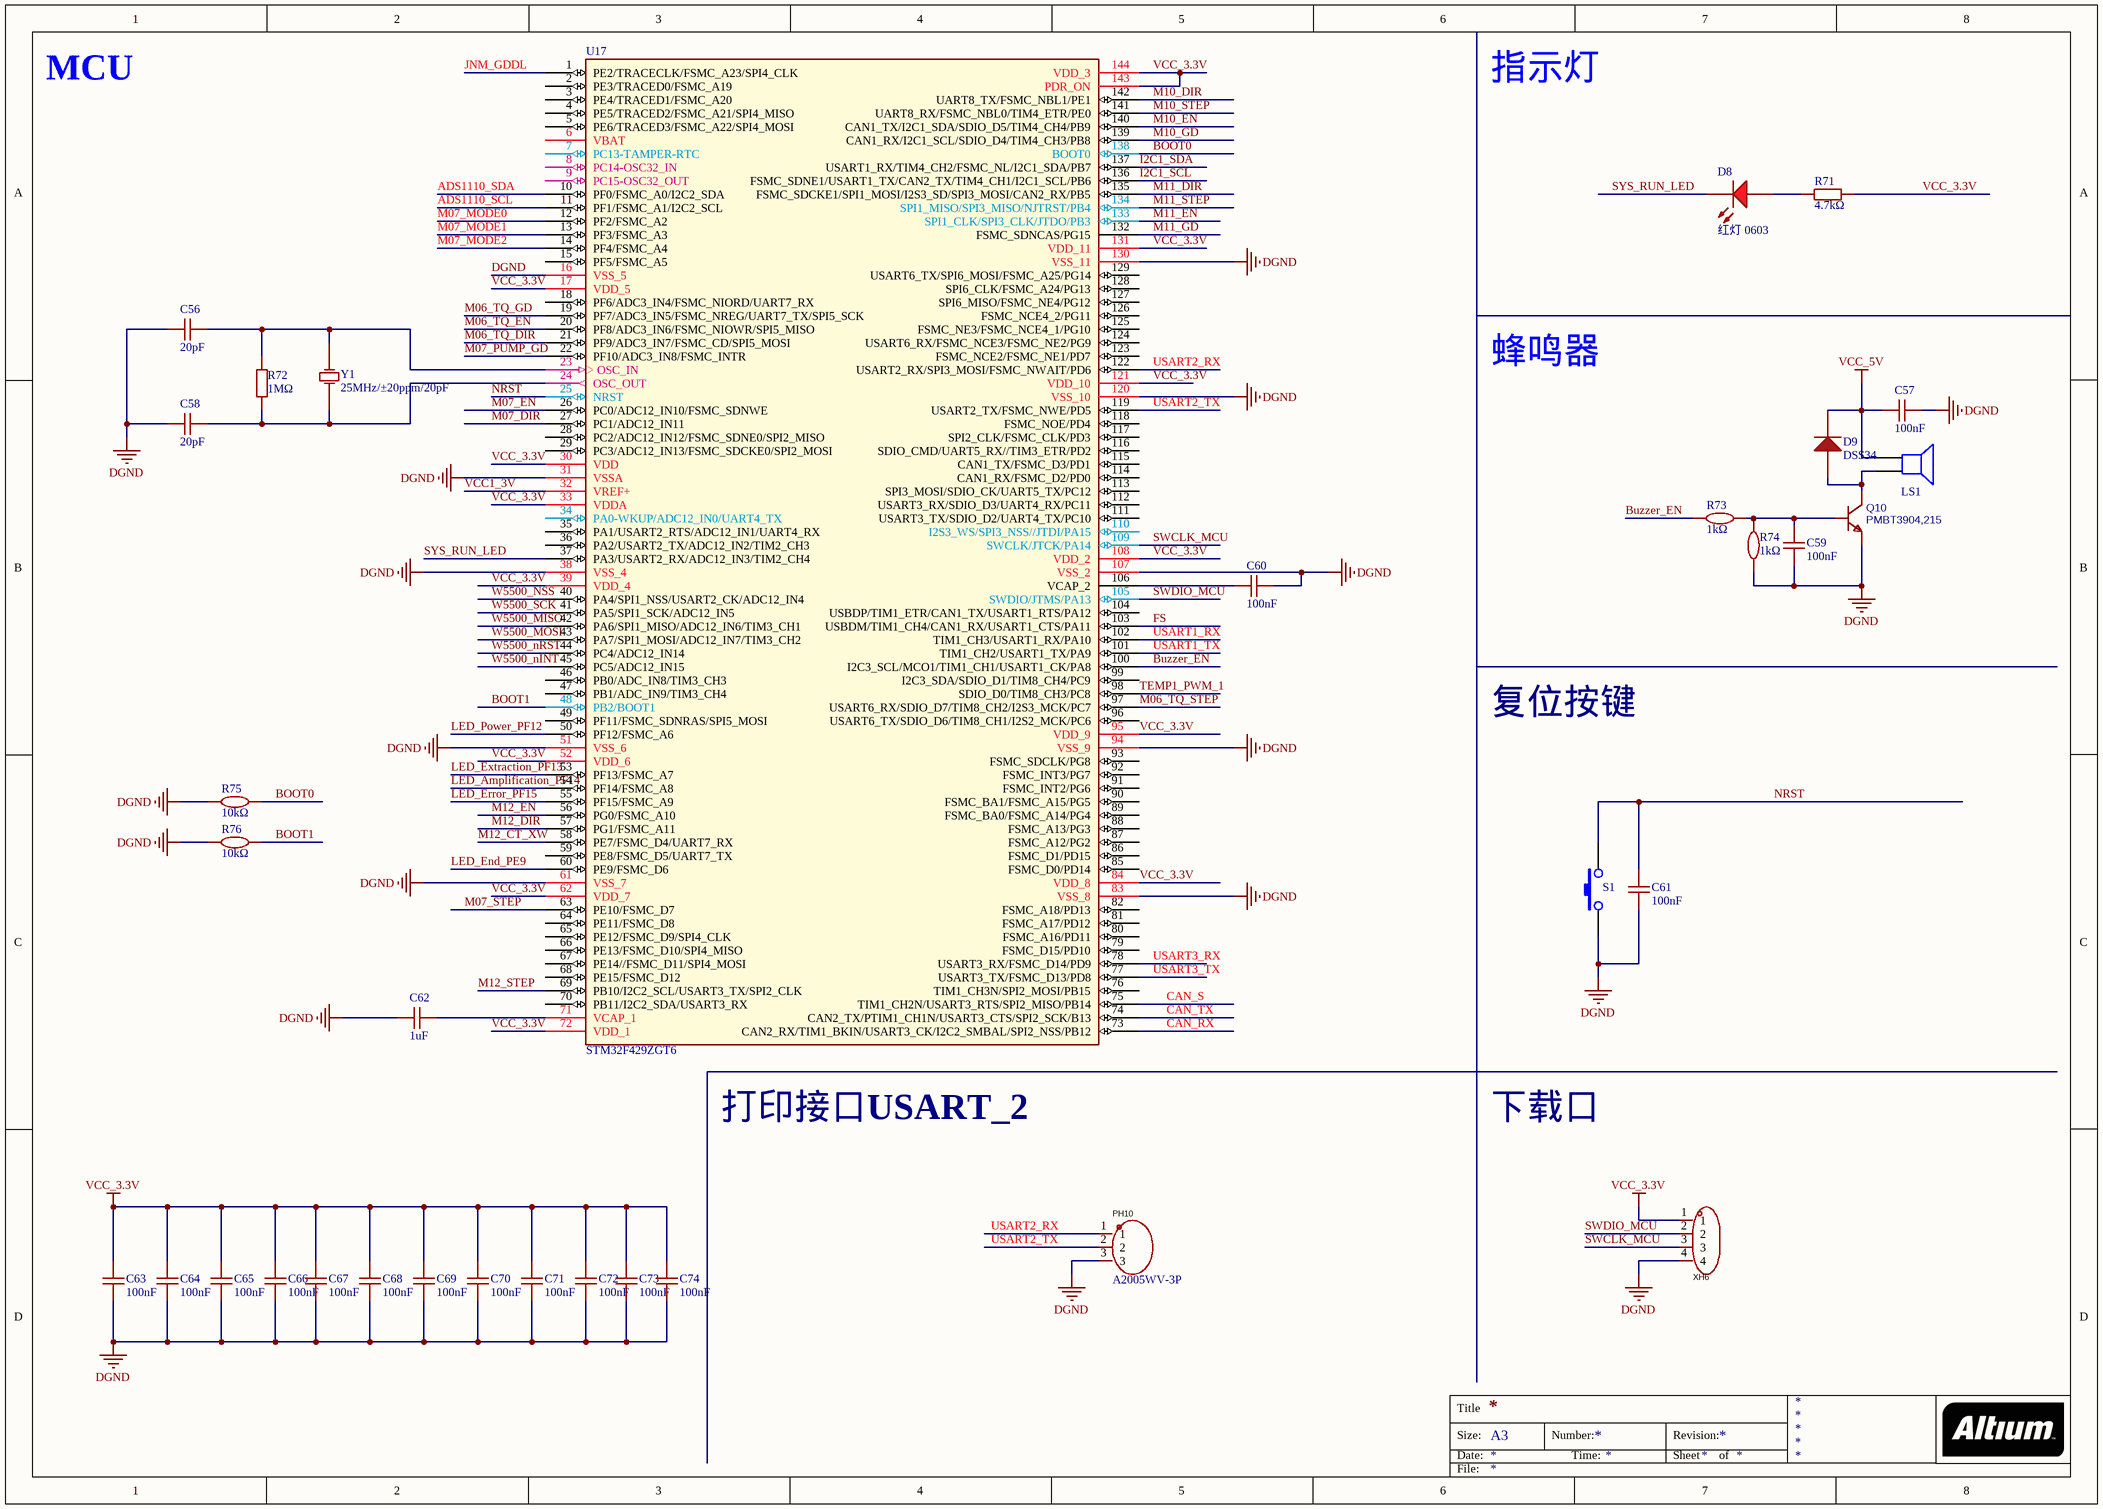
[diagram p6: STM32F429.SchDoc]

### Parts
C56  20pF  [C0603]
C57  100nF  [C0603]
C58  20pF  [C0603]
C59  100nF  [C0603]
C60  100nF  [C0402]
C61  100nF  [C0402]
C62  1uF  [C0402]
C63  100nF  [C0402]
C64  100nF  [C0402]
C65  100nF  [C0402]
C66  100nF  [C0402]
C67  100nF  [C0402]
C68  100nF  [C0402]
C69  100nF  [C0402]
C70  100nF  [C0402]
C71  100nF  [C0402]
C72  100nF  [C0402]
C73  100nF  [C0402]
C74  100nF  [C0402]
D8  红灯 0603  [LED_0603]
D9  DSS34  [SOD-123]
LS1  (no value)  [BUZZER]
PH10  A2005WV-3P  [HDR-TH_3P-P2.00-V-M]
Q10  PMBT3904,215  [SOT-23(SOT-23-3)]
R71  4.7kΩ  [R0603]
R72  1MΩ  [R0603]
R73  1kΩ  [R0603]
R74  1kΩ  [R0603]
R75  10kΩ  [R0402]
R76  10kΩ  [R0402]
S1  (no value)  [SW-S2 贴片]
U17  STM32F429ZGT6  [LQFP-144_20x20x05P]
XH6  A2541WV-4P  [HDR-TH_4P-P2.54-V-M]  (value not drawn)
Y1  25MHz/±20ppm/20pF  [SMD-5032_2P]

### Nets
DGND: C56.1 C57.2 C58.1 C59.1 C60.2 C61.1 C62.1 C63.1 C64.1 C65.1 C66.1 C67.1 C68.1 C69.1 C70.1 C71.1 C72.1 C73.1 C74.1 PH10.3 Q10.2 R74.2 R75.2 R76.2 S1.1 U17.16(VSS_5) U17.31(VSSA) U17.38(VSS_4) U17.51(VSS_6) U17.61(VSS_7) U17.83(VSS_8) U17.94(VSS_9) U17.107(VSS_2) U17.120(VSS_10) U17.130(VSS_11) XH6.4
VCC1_3V: U17.32(VREF+)
VCC_3.3V: C63.2 C64.2 C65.2 C66.2 C67.2 C68.2 C69.2 C70.2 C71.2 C72.2 C73.2 C74.2 R71.2 U17.17(VDD_5) U17.30(VDD) U17.33(VDDA) U17.39(VDD_4) U17.52(VDD_6) U17.62(VDD_7) U17.72(VDD_1) U17.84(VDD_8) U17.95(VDD_9) U17.108(VDD_2) U17.121(VDD_10) U17.131(VDD_11) U17.143(PDR_ON) U17.144(VDD_3) XH6.1
VCC_5V: C57.1 D9.2(K) LS1.1
ADS1110_SCL: U17.11(PF1/FSMC_A1/I2C2_SCL)
ADS1110_SDA: U17.10(PF0/FSMC_A0/I2C2_SDA)
BOOT0: R75.1 U17.138(BOOT0)
BOOT1: R76.1 U17.48(PB2/BOOT1)
Buzzer_EN: R73.2 U17.100(I2C3_SCL/MCO1/TIM1_CH1/USART1_CK/PA8)
CAN_RX: U17.73(CAN2_RX/TIM1_BKIN/USART3_CK/I2C2_SMBAL/SPI2_NSS/PB12)
CAN_S: U17.75(TIM1_CH2N/USART3_RTS/SPI2_MISO/PB14)
CAN_TX: U17.74(CAN2_TX/PTIM1_CH1N/USART3_CTS/SPI2_SCK/B13)
FS: U17.103(USBDM/TIM1_CH4/CAN1_RX/USART1_CTS/PA11)
I2C1_SCL: U17.136(FSMC_SDNE1/USART1_TX/CAN2_TX/TIM4_CH1/I2C1_SCL/PB6)
I2C1_SDA: U17.137(USART1_RX/TIM4_CH2/FSMC_NL/I2C1_SDA/PB7)
JNM_GDDL: U17.1(PE2/TRACECLK/FSMC_A23/SPI4_CLK)
LED_Amplification_PF14: U17.54(PF14/FSMC_A8)
LED_End_PE9: U17.60(PE9/FSMC_D6)
LED_Error_PF15: U17.55(PF15/FSMC_A9)
LED_Extraction_PF13: U17.53(PF13/FSMC_A7)
LED_Power_PF12: U17.50(PF12/FSMC_A6)
M06_TQ_DIR: U17.21(PF9/ADC3_IN7/FSMC_CD/SPI5_MOSI)
M06_TQ_EN: U17.20(PF8/ADC3_IN6/FSMC_NIOWR/SPI5_MISO)
M06_TQ_GD: U17.19(PF7/ADC3_IN5/FSMC_NREG/UART7_TX/SPI5_SCK)
M06_TQ_STEP: U17.97(USART6_RX/SDIO_D7/TIM8_CH2/I2S3_MCK/PC7)
M07_DIR: U17.27(PC1/ADC12_IN11)
M07_EN: U17.26(PC0/ADC12_IN10/FSMC_SDNWE)
M07_MODE0: U17.12(PF2/FSMC_A2)
M07_MODE1: U17.13(PF3/FSMC_A3)
M07_MODE2: U17.14(PF4/FSMC_A4)
M07_PUMP_GD: U17.22(PF10/ADC3_IN8/FSMC_INTR)
M07_STEP: U17.63(PE10/FSMC_D7)
M10_DIR: U17.142(UART8_TX/FSMC_NBL1/PE1)
M10_EN: U17.140(CAN1_TX/I2C1_SDA/SDIO_D5/TIM4_CH4/PB9)
M10_GD: U17.139(CAN1_RX/I2C1_SCL/SDIO_D4/TIM4_CH3/PB8)
M10_STEP: U17.141(UART8_RX/FSMC_NBL0/TIM4_ETR/PE0)
M11_DIR: U17.135(FSMC_SDCKE1/SPI1_MOSI/I2S3_SD/SPI3_MOSI/CAN2_RX/PB5)
M11_EN: U17.133(SPI1_CLK/SPI3_CLK/JTDO/PB3)
M11_GD: U17.132(FSMC_SDNCAS/PG15)
M11_STEP: U17.134(SPI1_MISO/SPI3_MISO/NJTRST/PB4)
M12_CT_XW: U17.58(PE7/FSMC_D4/UART7_RX)
M12_DIR: U17.57(PG1/FSMC_A11)
M12_EN: U17.56(PG0/FSMC_A10)
M12_STEP: U17.69(PB10/I2C2_SCL/USART3_TX/SPI2_CLK)
NRST: C61.2 S1.2 U17.25(NRST)
SWCLK_MCU: U17.109(SWCLK/JTCK/PA14) XH6.3
SWDIO_MCU: U17.105(SWDIO/JTMS/PA13) XH6.2
SYS_RUN_LED: D8.K U17.37(PA3/USART2_RX/ADC12_IN3/TIM2_CH4)
TEMP1_PWM_1: U17.98(SDIO_D0/TIM8_CH3/PC8)
USART1_RX: U17.102(TIM1_CH3/USART1_RX/PA10)
USART1_TX: U17.101(TIM1_CH2/USART1_TX/PA9)
USART2_RX: PH10.1 U17.122(USART2_RX/SPI3_MOSI/FSMC_NWAIT/PD6)
USART2_TX: PH10.2 U17.119(USART2_TX/FSMC_NWE/PD5)
USART3_RX: U17.78(USART3_RX/FSMC_D14/PD9)
USART3_TX: U17.77(USART3_TX/FSMC_D13/PD8)
W5500_MISO: U17.42(PA6/SPI1_MISO/ADC12_IN6/TIM3_CH1)
W5500_MOSI: U17.43(PA7/SPI1_MOSI/ADC12_IN7/TIM3_CH2)
W5500_nINT: U17.45(PC5/ADC12_IN15)
W5500_nRST: U17.44(PC4/ADC12_IN14)
W5500_NSS: U17.40(PA4/SPI1_NSS/USART2_CK/ADC12_IN4)
W5500_SCK: U17.41(PA5/SPI1_SCK/ADC12_IN5)
NetC56_2: C56.2 R72.2 U17.23(OSC_IN) Y1.2(OSC2)
NetC58_2: C58.2 R72.1 U17.24(OSC_OUT) Y1.1(OSC1)
NetC59_2: C59.2 Q10.1 R73.1 R74.1
NetC60_1: C60.1 U17.106(VCAP_2)
NetC62_2: C62.2 U17.71(VCAP_1)
NetD8_A: D8.A R71.1
NetD9_1: D9.1(A) LS1.2 Q10.3

Not connected (* = marked no-connect by the designer): U17 2(PE3/TRACED0/FSMC_A19) 3(PE4/TRACED1/FSMC_A20) 4(PE5/TRACED2/FSMC_A21/SPI4_MISO) 5(PE6/TRACED3/FSMC_A22/SPI4_MOSI) 6(VBAT) 7(PC13-TAMPER-RTC) 8(PC14-OSC32_IN) 9(PC15-OSC32_OUT) 15(PF5/FSMC_A5) 18(PF6/ADC3_IN4/FSMC_NIORD/UART7_RX) 28(PC2/ADC12_IN12/FSMC_SDNE0/SPI2_MISO) 29(PC3/ADC12_IN13/FSMC_SDCKE0/SPI2_MOSI) 34(PA0-WKUP/ADC12_IN0/UART4_TX) 35(PA1/USART2_RTS/ADC12_IN1/UART4_RX) 36(PA2/USART2_TX/ADC12_IN2/TIM2_CH3) 46(PB0/ADC_IN8/TIM3_CH3) 47(PB1/ADC_IN9/TIM3_CH4) 49(PF11/FSMC_SDNRAS/SPI5_MOSI) 59(PE8/FSMC_D5/UART7_TX) 64(PE11/FSMC_D8) 65(PE12/FSMC_D9/SPI4_CLK) 66(PE13/FSMC_D10/SPI4_MISO) 67(PE14//FSMC_D11/SPI4_MOSI) 68(PE15/FSMC_D12) 70(PB11/I2C2_SDA/USART3_RX) 76(TIM1_CH3N/SPI2_MOSI/PB15) 79(FSMC_D15/PD10) 80(FSMC_A16/PD11) 81(FSMC_A17/PD12) 82(FSMC_A18/PD13) 85(FSMC_D0/PD14) 86(FSMC_D1/PD15) 87(FSMC_A12/PG2) 88(FSMC_A13/PG3) 89(FSMC_BA0/FSMC_A14/PG4) 90(FSMC_BA1/FSMC_A15/PG5) 91(FSMC_INT2/PG6) 92(FSMC_INT3/PG7) 93(FSMC_SDCLK/PG8) 96(USART6_TX/SDIO_D6/TIM8_CH1/I2S2_MCK/PC6) 99(I2C3_SDA/SDIO_D1/TIM8_CH4/PC9) 104(USBDP/TIM1_ETR/CAN1_TX/USART1_RTS/PA12) 110(I2S3_WS/SPI3_NSS//JTDI/PA15) 111(USART3_TX/SDIO_D2/UART4_TX/PC10) 112(USART3_RX/SDIO_D3/UART4_RX/PC11) 113(SPI3_MOSI/SDIO_CK/UART5_TX/PC12) 114(CAN1_RX/FSMC_D2/PD0) 115(CAN1_TX/FSMC_D3/PD1) 116(SDIO_CMD/UART5_RX//TIM3_ETR/PD2) 117(SPI2_CLK/FSMC_CLK/PD3) 118(FSMC_NOE/PD4) 123(FSMC_NCE2/FSMC_NE1/PD7) 124(USART6_RX/FSMC_NCE3/FSMC_NE2/PG9) 125(FSMC_NE3/FSMC_NCE4_1/PG10) 126(FSMC_NCE4_2/PG11) 127(SPI6_MISO/FSMC_NE4/PG12) 128(SPI6_CLK/FSMC_A24/PG13) 129(USART6_TX/SPI6_MOSI/FSMC_A25/PG14)

### Notes on the sheet
- MCU
- 指示灯
- 蜂鸣器
- 复位按键
- 打印接口USART_2
- 下载口
- Title
- Size:
- Date:
- A3
- Number:
- Time:
- Revision:
- Sheet
- of
- File:

### Library data of the parts
C56 C58 = 20pF/50V,C0603: 贴片电容,X7R; ComponentLink1Description: 供应商链接; ComponentLink1URL: http://www.szlcsc.com/product/details_16531.html
C57 C59 = 100nF/50V,C0603: 贴片电容,X7R; ComponentLink1Description: 供应商链接; ComponentLink1URL: http://www.szlcsc.com/product/details_16531.html
C60 C61 C63-C74 = 100nF/50V,C0402: 贴片电容,X7R; ComponentLink1Description: 供应商链接; ComponentLink1URL: http://www.szlcsc.com/product/details_16531.html
C62 = 1uF/50V,C0402: 贴片电容,X7R; ComponentLink1Description: 供应商链接; ComponentLink1URL: http://www.szlcsc.com/product/details_16531.html
D8 = 红灯 0603: 发光二极管; ComponentLink1Description: 供应商链接; ComponentLink1URL: http://www.szlcsc.com/product/details_2659.html
D9 = DSS34,SOD-123: 肖特基二极管; ComponentLink1Description: 供应商链接; ComponentLink1URL: http://www.szlcsc.com/product/details_9093.html
LS1 = Speaker: Loudspeaker; Published: 24-Mar-1999; LatestRevisionDate: 17-Jul-2002; LatestRevisionNote: Re-released for DXP Platform.; PackageReference: PIN2; Publisher: Altium Limited
R71 = 4.7kΩ,R0603: 贴片电阻; ComponentLink1Description: 供应商链接; ComponentLink1URL: http://www.szlcsc.com/product/details_21904.html
R72 = 1MΩ,R0603: 贴片电阻; ComponentLink1Description: 供应商链接; ComponentLink1URL: http://www.szlcsc.com/product/details_23662.html
R73 R74 = 1kΩ,R0603: as R66 on sheet Power
R75 R76 = 10kΩ,R0402: as R1 on sheet EEPROM
S1 = SW-PB
U17 = STM32F429ZGT6: ARM; ComponentLink1Description: 供应商链接; ComponentLink1URL: http://www.szlcsc.com/product/details_47529.html
XH6 = A2541WV-4P: C5346656
Y1 = 25MHz/±20ppm/20pF,SMD5032: X503225MSB2GI;无源晶振; ComponentLink1Description: 供应商链接; ComponentLink1URL: http://www.szlcsc.com/product/details_117214.html

## Sheet Temp.SchDoc
size A4
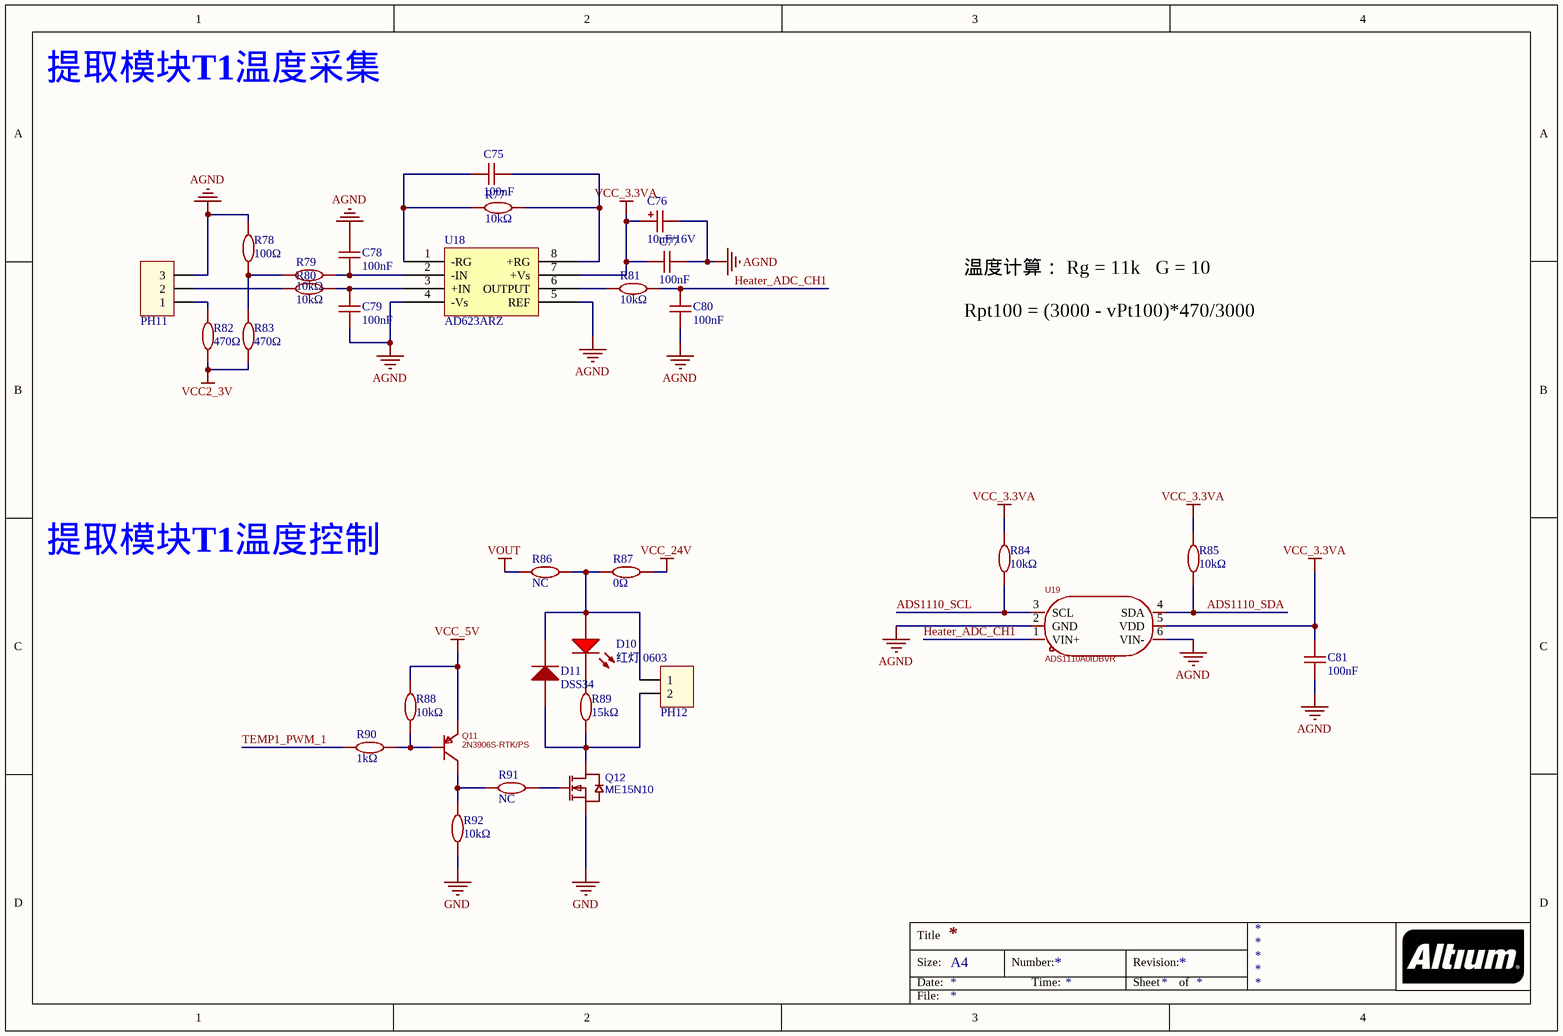
[diagram p7: Temp.SchDoc]

### Parts
C75  100nF  [C0603]
C76  10uF/16V  [CASE-A_3216]
C77  100nF  [C0603]
C78  100nF  [C0603]
C79  100nF  [C0603]
C80  100nF  [C0603]
C81  100nF  [C0603]
D10  红灯 0603  [LED_0603]
D11  DSS34  [SOD-123]
PH11  PH2.0-3P  [PH2.0-3P 弯针]  (value not drawn)
PH12  PH2.0-2P  [PH2.0-2P 弯针]  (value not drawn)
Q11  2N3906S-RTK/PS  [SOT-23-3_L2.9-W1.3-P1.90-LS2.4-TR]
Q12  ME15N10  [TO-252-2_L6.6-W6.1-P4.57-LS9.9-TL-CW]
R77  10kΩ  [R0603]
R78  100Ω  [R0603]
R79  10kΩ  [R0603]
R80  10kΩ  [R0603]
R81  10kΩ  [R0603]
R82  470Ω  [R0603]
R83  470Ω  [R0603]
R84  10kΩ  [R0603]
R85  10kΩ  [R0603]
R86  NC  [R1206]
R87  0Ω  [R1206]
R88  10kΩ  [R0603]
R89  15kΩ  [R0603]
R90  1kΩ  [R0603]
R91  NC  [R0603]
R92  10kΩ  [R0603]
U18  AD623ARZ  [SOP-8_150mil]
U19  ADS1110A0IDBVR  [SOT-23-6_L2.9-W1.6-P0.95-LS2.8-BR]

### Nets
AGND: C76.2 C77.2 C78.2 C79.1 C80.1 C81.1 PH11.3 R78.2 U18.4(-Vs) U18.5(REF) U19.2(GND) U19.6(VIN-)
GND: Q12.3(S) R92.2
VCC2_3V: R82.1 R83.1
VCC_3.3VA: C76.1 C77.1 C81.2 R84.1 R85.1 U18.7(+Vs) U19.5(VDD)
VCC_5V: Q11.1(E) R88.1
VCC_24V: R87.2
VOUT: R86.1
ADS1110_SCL: R84.2 U19.3(SCL)
ADS1110_SDA: R85.2 U19.4(SDA)
Heater_ADC_CH1: C80.2 R81.2 U19.1(VIN+)
TEMP1_PWM_1: R90.1
NetC75_1: C75.1 R77.1 U18.1(-RG)
NetC75_2: C75.2 R77.2 U18.8(+RG)
NetC78_1: C78.1 R79.1 U18.2(-IN)
NetC79_2: C79.2 R80.1 U18.3(+IN)
NetD10_A: D10.A D11.2(K) PH12.1 R86.2 R87.1
NetD10_K: D10.K R89.2
NetD11_1: D11.1(A) PH12.2 Q12.2(D) R89.1
NetPH11_1: PH11.1 R82.2
NetPH11_2: PH11.2 R80.2
NetQ11_2: Q11.2(B) R88.2 R90.2
NetQ11_3: Q11.3(C) R91.1 R92.1
NetQ12_1: Q12.1(G) R91.2
NetR78_1: R78.1 R79.2 R83.2
NetR81_1: R81.1 U18.6(OUTPUT)

### Notes on the sheet
- 提取模块T1温度采集
- 温度计算： Rg = 11k   G = 10
  Rpt100 = (3000 - vPt100)*470/3000
- 提取模块T1温度控制
- Title
- Size:
- Date:
- A4
- Number:
- Time:
- Revision:
- Sheet
- of
- File:

### Library data of the parts
C75 C77-C81 = 100nF/50V,C0603: 贴片电容,X7R; ComponentLink1Description: 供应商链接; ComponentLink1URL: http://www.szlcsc.com/product/details_16531.html
C76 = 10uF/16V,CASE-A_3216 : 钽电容;±10%;16V; ComponentLink1Description: 供应商链接; ComponentLink1URL: http://www.szlcsc.com/product/details_7643.html
D10 = 红灯 0603: 发光二极管; ComponentLink1Description: 供应商链接; ComponentLink1URL: http://www.szlcsc.com/product/details_2659.html
D11 = DSS34,SOD-123: 肖特基二极管; ComponentLink1Description: 供应商链接; ComponentLink1URL: http://www.szlcsc.com/product/details_9093.html
Q11 = 2N3906S-RTK/PS: as Q8 on sheet Power; Device: 2N3906S-RTK/PS; LCSC Part Name: 2N3906S-RTK/PS; Supplier Part: C5300004; Manufacturer Part: 2N3906S-RTK/PS; Supplier Footprint: SOT-23; JLCPCB Part Class: Extended Part; Datasheet: https://item.szlcsc.com/datasheet/2N3906S-RTK%252FPS/6051230.html; Supplier: LCSC; Convert to PCB: yes
Q12 = ME15N10: 场效应管(MOSFET);N沟道
R77 R79-R81 R84 R85 R88 R92 = 10kΩ,R0603: as R60 on sheet Power
R78 = 100Ω,R0603: 贴片电阻
R82 R83 = 470Ω,R0603: 贴片电阻
R86 = NC,R1206: 贴片电阻
R87 = 0Ω,R1206: 贴片电阻
R89 = 15kΩ,R0603: 贴片电阻
R90 = 1kΩ,R0603: as R66 on sheet Power
R91 = NC,R0603
U18 = AD623ARZ: 仪表放大器；（可替代芯片AD623ARZ-R7）单路；共模抑制比(CMRR) 80dB；输入偏置电流(Ib) 25nA；输入失调电压(Vos) 25uV；压摆率(SR) 0.3V/us；带宽(-3db) 800kHz；轨到轨 轨到轨输出；每个通道工作电流 305uA、375uA；输入失调电压温漂(Vos TC) 0.1uV/℃；工作电压 2.5V~6V；2.7V~12V
U19 = ADS1110A0IDBVR: Manufacturer: TI(德州仪器); Add into BOM: yes; Resolution(Bits): 16位; Sampling Rate: 15Hz; number of channels: 1; Voltage - Supply: 2.7V~5.5V; Interface: I2C; Symbol: ADS1110A0IDBVR; Device: ADS1110A0IDBVR; LCSC Part Name: 16位模拟到数字转换器 带板载参考源; Supplier Part: C16598; Manufacturer Part: ADS1110A0IDBVR; Supplier Footprint: SOT-23-6; JLCPCB Part Class: Extended Part; Datasheet: http://www.ti.com/cn/lit/gpn/ads1110; Supplier: LCSC; Convert to PCB: yes; differential input: -; Integral non - linearity: -; Operating Temperature: -

## Sheet W5500.SchDoc
size A4
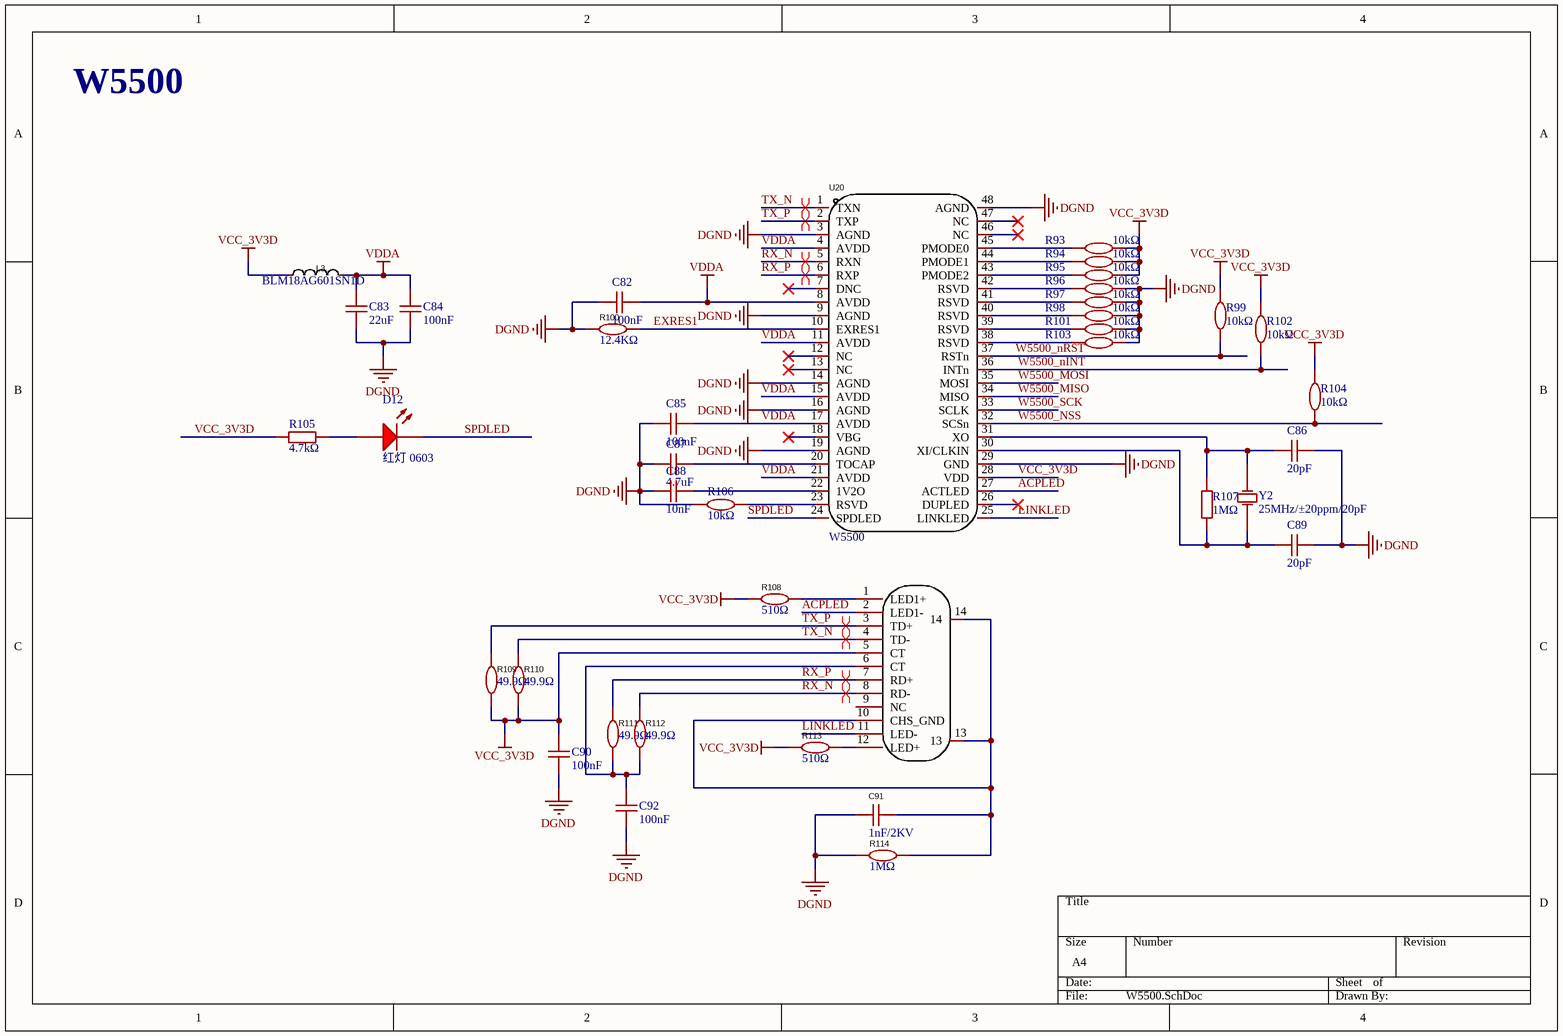
[diagram p8: W5500.SchDoc]

### Parts
C82  100nF  [C0402]
C83  22uF  [C0603]
C84  100nF  [C0402]
C85  100nF  [C0402]
C86  20pF  [C0603]
C87  4.7uF  [C0402]
C88  10nF  [C0402]
C89  20pF  [C0603]
C90  100nF  [C0402]
C91  1nF/2KV  [C1206]
C92  100nF  [C0402]
D12  红灯 0603  [LED_0603]
L3  BLM18AG601SN1D  [L0603]
R93  10kΩ  [R0402]
R94  10kΩ  [R0402]
R95  10kΩ  [R0402]
R96  10kΩ  [R0402]
R97  10kΩ  [R0402]
R98  10kΩ  [R0402]
R99  10kΩ  [R0402]
R100  12.4KΩ  [R0402]
R101  10kΩ  [R0402]
R102  10kΩ  [R0402]
R103  10kΩ  [R0402]
R104  10kΩ  [R0402]
R105  4.7kΩ  [R0603]
R106  10kΩ  [R0402]
R107  1MΩ  [R0603]
R108  510Ω  [R0402]
R109  49.9Ω  [R0402]
R110  49.9Ω  [R0402]
R111  49.9Ω  [R0402]
R112  49.9Ω  [R0402]
R113  510Ω  [R0402]
R114  1MΩ  [R0402]
RJ1  HR961160C  [RJ45-SMD_HR961160C]  (value not drawn)
U20  W5500  [LQFP-48_L7.0-W7.0-P0.50-LS9.0-BL]
Y2  25MHz/±20ppm/20pF  [SMD-5032_2P]

### Nets
DGND: C82.1 C83.1 C84.1 C85.1 C86.2 C87.1 C88.1 C89.2 C90.1 C91.1 C92.1 R96.1 R97.1 R98.1 R100.1 R101.1 R103.1 R106.2 R114.1 U20.3(AGND) U20.9(AGND) U20.14(AGND) U20.16(AGND) U20.19(AGND) U20.29(GND) U20.48(AGND)
VCC_3V3D: C90.2 L3.1 R93.1 R94.1 R95.1 R99.1 R102.1 R104.1 R105.2 R108.2 R109.1 R110.1 R113.2 RJ1.5(CT) U20.28(VDD)
VDDA: C82.2 C83.2 C84.2 C85.2 L3.2 U20.4(AVDD) U20.8(AVDD) U20.11(AVDD) U20.15(AVDD) U20.17(AVDD) U20.21(AVDD)
ACPLED: RJ1.2(LED1-) U20.27(ACTLED)
EXRES1: R100.2 U20.10(EXRES1)
LINKLED: RJ1.11(LED-) U20.25(LINKLED)
RX_N: R112.2 RJ1.8(RD-) U20.5(RXN)
RX_P: R111.2 RJ1.7(RD+) U20.6(RXP)
SPDLED: D12.K U20.24(SPDLED)
TX_N: R110.2 RJ1.4(TD-) U20.1(TXN)
TX_P: R109.2 RJ1.3(TD+) U20.2(TXP)
W5500_MISO: U20.34(MISO)
W5500_MOSI: U20.35(MOSI)
W5500_nINT: R102.2 U20.36(INTn)
W5500_nRST: R99.2 U20.37(RSTn)
W5500_NSS: R104.2 U20.32(SCSn)
W5500_SCK: U20.33(SCLK)
NetC86_1: C86.1 R107.2 U20.31(XO) Y2.2(OSC2)
NetC87_2: C87.2 U20.20(TOCAP)
NetC88_2: C88.2 U20.22(1V2O)
NetC89_1: C89.1 R107.1 U20.30(XI/CLKIN) Y2.1(OSC1)
NetC91_2: C91.2 R114.2 RJ1.10(CHS_GND) RJ1.13 RJ1.14
NetC92_2: C92.2 R111.1 R112.1 RJ1.6(CT)
NetD12_A: D12.A R105.1
NetR93_2: R93.2 U20.45(PMODE0)
NetR94_2: R94.2 U20.44(PMODE1)
NetR95_2: R95.2 U20.43(PMODE2)
NetR96_2: R96.2 U20.42(RSVD)
NetR97_2: R97.2 U20.41(RSVD)
NetR98_2: R98.2 U20.40(RSVD)
NetR101_2: R101.2 U20.39(RSVD)
NetR103_2: R103.2 U20.38(RSVD)
NetR106_1: R106.1 U20.23(RSVD)
NetR108_1: R108.1 RJ1.1(LED1+)
NetR113_1: R113.1 RJ1.12(LED+)

Not connected (* = marked no-connect by the designer): RJ1 9(NC); U20 7(DNC)* 12(NC)* 13(NC)* 18(VBG)* 26(DUPLED)* 46(NC)* 47(NC)*

### Layout directives
differential pair: RX_N, RX_P, TX_N, TX_P

### Notes on the sheet
- W5500

### Library data of the parts
C82 C84 C85 C90 C92 = 100nF/50V,C0402: 贴片电容,X7R; ComponentLink1Description: 供应商链接; ComponentLink1URL: http://www.szlcsc.com/product/details_16531.html
C83 = 22uF/50V,C0603: 贴片电容,X7R; ComponentLink1Description: 供应商链接; ComponentLink1URL: http://www.szlcsc.com/product/details_16531.html
C86 C89 = 20pF/50V,C0603: 贴片电容,X7R; ComponentLink1Description: 供应商链接; ComponentLink1URL: http://www.szlcsc.com/product/details_16531.html
C87 = 4.7uF/50V,C0402: 贴片电容,X7R; ComponentLink1Description: 供应商链接; ComponentLink1URL: http://www.szlcsc.com/product/details_16531.html
C88 = 10nF/50V,C0402: 贴片电容,X7R; ComponentLink1Description: 供应商链接; ComponentLink1URL: http://www.szlcsc.com/product/details_16531.html
C91 = 1nF/2KV,C1206: 贴片电容,X7R
D12 = 红灯 0603: 发光二极管; ComponentLink1Description: 供应商链接; ComponentLink1URL: http://www.szlcsc.com/product/details_2659.html
L3 = BLM18AG601SN1D: Manufacturer: muRata(村田); Add into BOM: yes; Impedance @ Frequency: 600Ω@100MHz; Tolerance: ±25%; DC Resistance: 380mΩ; Current Rating: 500mA; Circuits: 1; Name: BLM18AG601SN1D; Symbol: BLM18AG601SN1D; Device: BLM18AG601SN1D; LCSC Part Name: 单路 0603磁珠 阻抗600Ω@100MHz; Supplier Part: C19330; Manufacturer Part: BLM18AG601SN1D; Supplier Footprint: 0603; JLCPCB Part Class: Extended Part; Datasheet: https://atta.szlcsc.com/upload/public/pdf/source/20180326/C19330_93F4AC33FF94C8E22511353688ADC0FA.pdf; Supplier: LCSC; Convert to PCB: yes
R93-R99 R101-R104 R106 = 10kΩ,R0402: as R1 on sheet EEPROM
R100 = 12.4KΩ,R0402: 贴片电阻12.4KΩ;1%
R105 = 4.7kΩ,R0603: 贴片电阻; ComponentLink1Description: 供应商链接; ComponentLink1URL: http://www.szlcsc.com/product/details_21904.html
R107 = 1MΩ,R0603: 贴片电阻; ComponentLink1Description: 供应商链接; ComponentLink1URL: http://www.szlcsc.com/product/details_23662.html
R108 R113 = 510Ω,R0402: 贴片电阻
R109-R112 = 49.9Ω,R0402: 贴片电阻49.9R;1%
R114 = 1MΩ,R0402: 电阻类型:厚膜电阻;阻值:1MΩ;精度:±1%;功率:100mW;最大工作电压:75V;温度系数:±100ppm/℃;
Y2 = 25MHz/±20ppm/20pF,SMD5032: X503225MSB2GI;无源晶振; ComponentLink1Description: 供应商链接; ComponentLink1URL: http://www.szlcsc.com/product/details_117214.html

## Sheet CAN.SchDoc
size A4
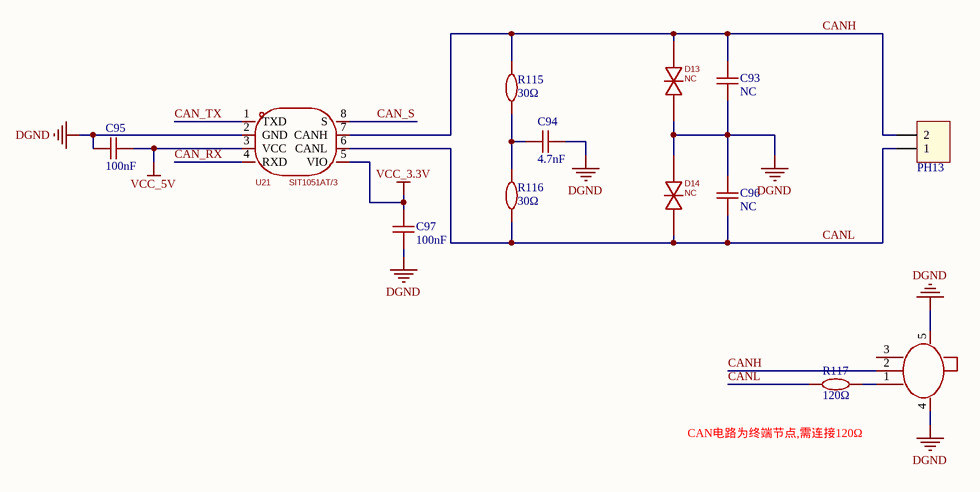
[diagram p9: CAN.SchDoc]

### Parts
C93  NC  [C0603]
C94  4.7nF  [C0603]
C95  100nF  [C0603]
C96  NC  [C0603]
C97  100nF  [C0603]
D13  NC  [SOD-523_L1.2-W0.8-LS1.6-BI]
D14  NC  [SOD-523_L1.2-W0.8-LS1.6-BI]
PH13  PH2.0-2P  [PH2.0-2P 弯针]  (value not drawn)
R115  30Ω  [R0603]
R116  30Ω  [R0603]
R117  120Ω  [R0603]
SW1  MINI MSK12CO2  [SW-SMD_MSK12CO2]  (value not drawn)
U21  SIT1051AT/3  [SOP-8_L4.9-W3.9-P1.27-LS6.0-BL]

### Nets
DGND: C93.1 C94.2 C95.2 C96.2 C97.2 D13.1(C) D14.2(A) SW1.4 SW1.5 U21.2(GND)
VCC_3.3V: C97.1 U21.5(VIO)
VCC_5V: C95.1 U21.3(VCC)
CAN_RX: U21.4(RXD)
CAN_S: U21.8(S)
CAN_TX: U21.1(TXD)
CANH: C93.2 D13.2(A) PH13.2 R115.2 SW1.2 U21.7(CANH)
CANL: C96.1 D14.1(C) PH13.1 R116.1 R117.2 U21.6(CANL)
NetC94_1: C94.1 R115.1 R116.2
NetR117_1: R117.1 SW1.1

Not connected (* = marked no-connect by the designer): SW1 3

### Notes on the sheet
- CAN电路为终端节点,需连接120Ω

### Library data of the parts
C93 C96 = NC,C0603: ComponentLink1Description: 供应商链接; ComponentLink1URL: http://www.szlcsc.com/product/details_16531.html
C94 = 4.7nF/50V,C0603: 贴片电容,X7R; ComponentLink1Description: 供应商链接; ComponentLink1URL: http://www.szlcsc.com/product/details_16531.html
C95 C97 = 100nF/50V,C0603: 贴片电容,X7R; ComponentLink1Description: 供应商链接; ComponentLink1URL: http://www.szlcsc.com/product/details_16531.html
D13 D14 = NC,RSB6.8STE61: RSB6.8STE61
R115 R116 = 30Ω,R0603: 贴片电阻
R117 = 120Ω,R0603: 贴片电阻
SW1 = MINI MSK12CO2: Manufacturer: SHOU HAN(首韩); Add into BOM: yes; Circuit: 单刀双掷; Actuator Style: 矩形柱状; Switch Height: 1.4mm; Actuator Color: 白色; Current Rating: 50mA; Voltage Rating: 12V; Life: 1万次; Symbol: MINI MSK12CO2; Device: MINI MSK12CO2; LCSC Part Name: 迷你七脚两档侧拨拨动 mini七7脚 微型拨动; Supplier Part: C2681570; Manufacturer Part: MINI MSK12CO2; Supplier Footprint: SMD; JLCPCB Part Class: Extended Part; Datasheet: https://item.szlcsc.com/datasheet/MINI%2520MSK12CO2/2774913.html; Supplier: LCSC; Convert to PCB: yes; Termination Style: SMD接片; Length: 5mm; Width: 2.75mm; Mounting Type: 卧贴; Operating Temperature: -25℃~+70℃
U21 = SIT1051AT/3: Manufacturer: SIT(芯力特); Add into BOM: yes; Data Rate: 5Mbps; Supply Voltage: 4.5V~5.5V; Symbol: SIT1051AT/3; Device: SIT1051AT/3; LCSC Part Name: SIT1051A CAN FD静音模式总线收发器; Supplier Part: C5382551; Manufacturer Part: SIT1051AT/3; Supplier Footprint: SOP-8; JLCPCB Part Class: Extended Part; Datasheet: https://atta.szlcsc.com/upload/public/pdf/source/20230320/C85B42C3F9CED8A268DA50D1BF0BE466.pdf; Supplier: LCSC; Convert to PCB: yes; Type: CAN-FD收发器; Supply Current: -; Operating Temperature: -40℃~+150℃

## Sheet RS232.SchDoc
size A4
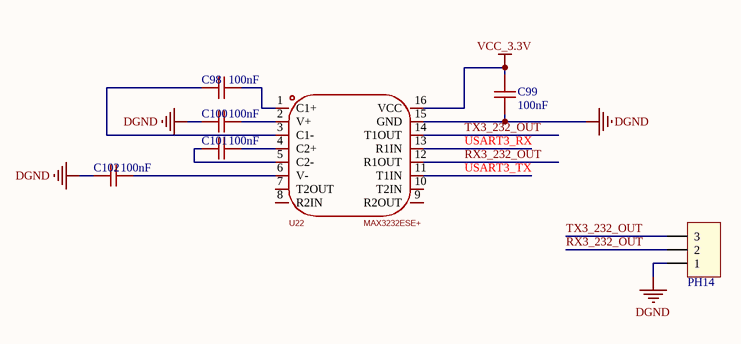
[diagram p10: RS232.SchDoc]

### Parts
C98  100nF  [C0603]
C99  100nF  [C0603]
C100  100nF  [C0603]
C101  100nF  [C0603]
C102  100nF  [C0603]
PH14  PH2.0-3P  [PH2.0-3P 弯针]  (value not drawn)
U22  MAX3232ESE+  [SOIC-16_L9.9-W3.9-P1.27-LS6.0-BL]

### Nets
DGND: C99.1 C100.2 C102.2 PH14.1 U22.15(GND)
VCC_3.3V: C99.2 U22.16(VCC)
RX3_232_OUT: PH14.2 U22.12(R1OUT)
TX3_232_OUT: PH14.3 U22.14(T1OUT)
USART3_RX: U22.13(R1IN)
USART3_TX: U22.11(T1IN)
NetC98_1: C98.1 U22.1(C1+)
NetC98_2: C98.2 U22.3(C1-)
NetC100_1: C100.1 U22.2(V+)
NetC101_1: C101.1 U22.4(C2+)
NetC101_2: C101.2 U22.5(C2-)
NetC102_1: C102.1 U22.6(V-)

Not connected (* = marked no-connect by the designer): U22 7(T2OUT) 8(R2IN) 9(R2OUT) 10(T2IN)

### Library data of the parts
C98-C102 = 100nF/50V,C0603: 贴片电容,X7R; ComponentLink1Description: 供应商链接; ComponentLink1URL: http://www.szlcsc.com/product/details_16531.html
U22 = MAX3232ESE+: Manufacturer: ADI(亚德诺)/MAXIM(美信); Add into BOM: yes; Number of Drivers: 2; Data Rate: 235Kbps; Voltage - Supply: 3V~5.5V; ESD Protect: ±15kV; charge pump: 有; Symbol: MAX3232ESE+; Device: MAX3232ESE+; LCSC Part Name: MAX3222/MAX3232/MAX3237/MAX3241 3.0V 至 5.5V，低功耗，最高 1Mbps，真正的 RS-232 收发器使用四个 0.1uF 外部电容; Supplier Part: C143435; Manufacturer Part: MAX3232ESE+; Supplier Footprint: SOIC-16; JLCPCB Part Class: Extended Part; Datasheet: https://item.szlcsc.com/datasheet/MAX3232ESE%252B/154766.html; Supplier: LCSC; Convert to PCB: yes; Type: 收发器; Number of Receivers: 2; Operating Temperature: -40℃~+85℃

## Sheet USB.SchDoc
size A4
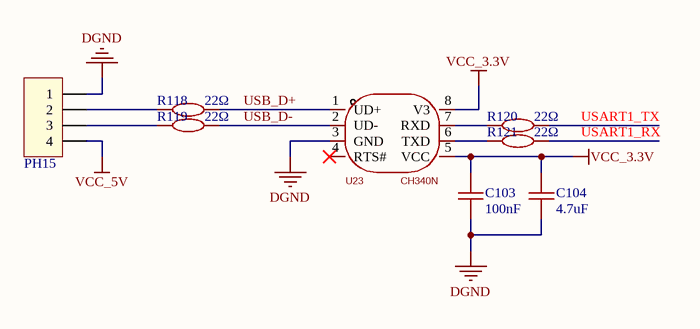
[diagram p11: USB.SchDoc]

### Parts
C103  100nF  [C0603]
C104  4.7uF  [C0603]
PH15  PH2.0-4P  [PH2.0-4P 弯针]  (value not drawn)
R118  22Ω  [R0603]
R119  22Ω  [R0603]
R120  22Ω  [R0603]
R121  22Ω  [R0603]
U23  CH340N  [SOP-8_L4.9-W3.9-P1.27-LS6.0-BL]

### Nets
DGND: C103.1 C104.1 PH15.1 U23.3(GND)
VCC_3.3V: C103.2 C104.2 U23.5(VCC) U23.8(V3)
VCC_5V: PH15.4
USART1_RX: R121.2
USART1_TX: R120.2
USB_D+: R118.2 U23.1(UD+)
USB_D-: R119.2 U23.2(UD-)
NetPH15_2: PH15.2 R118.1
NetPH15_3: PH15.3 R119.1
NetR120_1: R120.1 U23.7(RXD)
NetR121_1: R121.1 U23.6(TXD)

Not connected (* = marked no-connect by the designer): U23 4(RTS#)*

### Library data of the parts
C103 = 100nF/50V,C0603: 贴片电容,X7R; ComponentLink1Description: 供应商链接; ComponentLink1URL: http://www.szlcsc.com/product/details_16531.html
C104 = 4.7uF/50V,C0603: 贴片电容,X7R; ComponentLink1Description: 供应商链接; ComponentLink1URL: http://www.szlcsc.com/product/details_16531.html
R118-R121 = 22Ω,R0603: 电阻类型:厚膜电阻;阻值:22Ω;精度:±1%;功率:100mW;最大工作电压:75V;温度系数:±100ppm/℃;
U23 = CH340N: Manufacturer: WCH(南京沁恒); Symbol: CH340N_C2977777; Add into BOM: yes; Applications Function: USB转串口; Protocol: USB 2.0; Number of Channels: 1; Voltage - Supply: 3.3V；5V; Data Rate: 2Mbps; Device: CH340N; LCSC Part Name: USB2.0芯片CH340; Supplier Part: C2977777; Manufacturer Part: CH340N; Supplier Footprint: SOP-8; JLCPCB Part Class: Extended Part; Datasheet: https://atta.szlcsc.com/upload/public/pdf/source/20240313/115CDE92081B1D6CB446704AD5D0F5F2.pdf; Supplier: LCSC; Convert to PCB: yes; Operating Temperature: -20℃~+70℃

## Nets that join several sheets
AGND: Power (10 pins), Temp (12 pins)
DGND: Power (9 pins), EEPROM (5 pins), STM32F429 (36 pins), W5500 (26 pins), CAN (10 pins), RS232 (5 pins), USB (C103.1 C104.1 PH15.1 U23.3)
GND: Power (45 pins), LED (XH1.6), Motor (54 pins), Temp (Q12.3 R92.2)
VCC1_3V: Power (C49.1 U15.2), STM32F429 (U17.32)
VCC2_3V: Power (C48.1 U14.2), Temp (R82.1 R83.1)
VCC_3.3V: Power (C35.1 C43.2 U11.2 U11.4), EEPROM (R1.2 R2.1 U1.8), STM32F429 (28 pins), CAN (C97.1 U21.5), RS232 (C99.2 U22.16), USB (C103.2 C104.2 U23.5 U23.8)
VCC_3.3VA: Power (C37.1 C45.2 U12.2 U12.4), Temp (7 pins)
VCC_3V3: Power (5 pins), Motor (6 pins)
VCC_3V3D: Power (C39.1 C47.2 U13.2 U13.4), W5500 (15 pins)
VCC_5V: Power (26 pins), LED (10 pins), Motor (31 pins), STM32F429 (C57.1 D9.2 LS1.1), Temp (Q11.1 R88.1), CAN (C95.1 U21.3), USB (PH15.4)
VCC_12V: Power (5 pins), Motor (R38.1)
VCC_24V: Power (17 pins), Motor (14 pins), Temp (R87.2)
VOUT: Power (5 pins), Temp (R86.1)
ADS1110_SCL: STM32F429 (U17.11), Temp (R84.2 U19.3)
ADS1110_SDA: STM32F429 (U17.10), Temp (R85.2 U19.4)
CAN_RX: STM32F429 (U17.73), CAN (U21.4)
CAN_S: STM32F429 (U17.75), CAN (U21.8)
CAN_TX: STM32F429 (U17.74), CAN (U21.1)
FS: Motor (R45.2), STM32F429 (U17.103)
I2C1_SCL: EEPROM (R1.1 U1.6), STM32F429 (U17.136)
I2C1_SDA: EEPROM (R2.2 U1.5), STM32F429 (U17.137)
JNM_GDDL: Power (R66.1), STM32F429 (U17.1)
LED_Amplification_PF14: LED (R14.2), STM32F429 (U17.54)
LED_End_PE9: LED (R8.2), STM32F429 (U17.60)
LED_Error_PF15: LED (R15.2), STM32F429 (U17.55)
LED_Extraction_PF13: LED (R7.2), STM32F429 (U17.53)
LED_Power_PF12: LED (R6.2), STM32F429 (U17.50)
M06_TQ_DIR: Motor (U5.12), STM32F429 (U17.21)
M06_TQ_EN: Motor (U5.10), STM32F429 (U17.20)
M06_TQ_GD: Motor (U3.19), STM32F429 (U17.19)
M06_TQ_STEP: Motor (U5.11), STM32F429 (U17.97)
M07_DIR: Motor (U2.20), STM32F429 (U17.27)
M07_EN: Motor (U2.21), STM32F429 (U17.26)
M07_MODE0: Motor (U2.24), STM32F429 (U17.12)
M07_MODE1: Motor (U2.25), STM32F429 (U17.13)
M07_MODE2: Motor (U2.26), STM32F429 (U17.14)
M07_PUMP_GD: Motor (U3.20), STM32F429 (U17.22)
M07_STEP: Motor (U2.22), STM32F429 (U17.63)
M10_DIR: Motor (U4.20), STM32F429 (U17.142)
M10_EN: Motor (U4.21), STM32F429 (U17.140)
M10_GD: Motor (U3.17), STM32F429 (U17.139)
M10_STEP: Motor (U4.22), STM32F429 (U17.141)
M11_DIR: Motor (U6.12), STM32F429 (U17.135)
M11_EN: Motor (U6.10), STM32F429 (U17.133)
M11_GD: Motor (U3.16), STM32F429 (U17.132)
M11_STEP: Motor (U6.11), STM32F429 (U17.134)
M12_CT_XW: Motor (U3.18), STM32F429 (U17.58)
M12_DIR: Motor (U7.12), STM32F429 (U17.57)
M12_EN: Motor (U7.10), STM32F429 (U17.56)
M12_STEP: Motor (U7.11), STM32F429 (U17.69)
TEMP1_PWM_1: STM32F429 (U17.98), Temp (R90.1)
USART1_RX: STM32F429 (U17.102), USB (R121.2)
USART1_TX: STM32F429 (U17.101), USB (R120.2)
USART3_RX: STM32F429 (U17.78), RS232 (U22.13)
USART3_TX: STM32F429 (U17.77), RS232 (U22.11)
W5500_MISO: STM32F429 (U17.42), W5500 (U20.34)
W5500_MOSI: STM32F429 (U17.43), W5500 (U20.35)
W5500_nINT: STM32F429 (U17.45), W5500 (R102.2 U20.36)
W5500_nRST: STM32F429 (U17.44), W5500 (R99.2 U20.37)
W5500_NSS: STM32F429 (U17.40), W5500 (R104.2 U20.32)
W5500_SCK: STM32F429 (U17.41), W5500 (U20.33)